# EAGLE design TeensyCtrlr (EAGLE 7.2.0)

## Sheet 1 of 5: Audio Amplifier
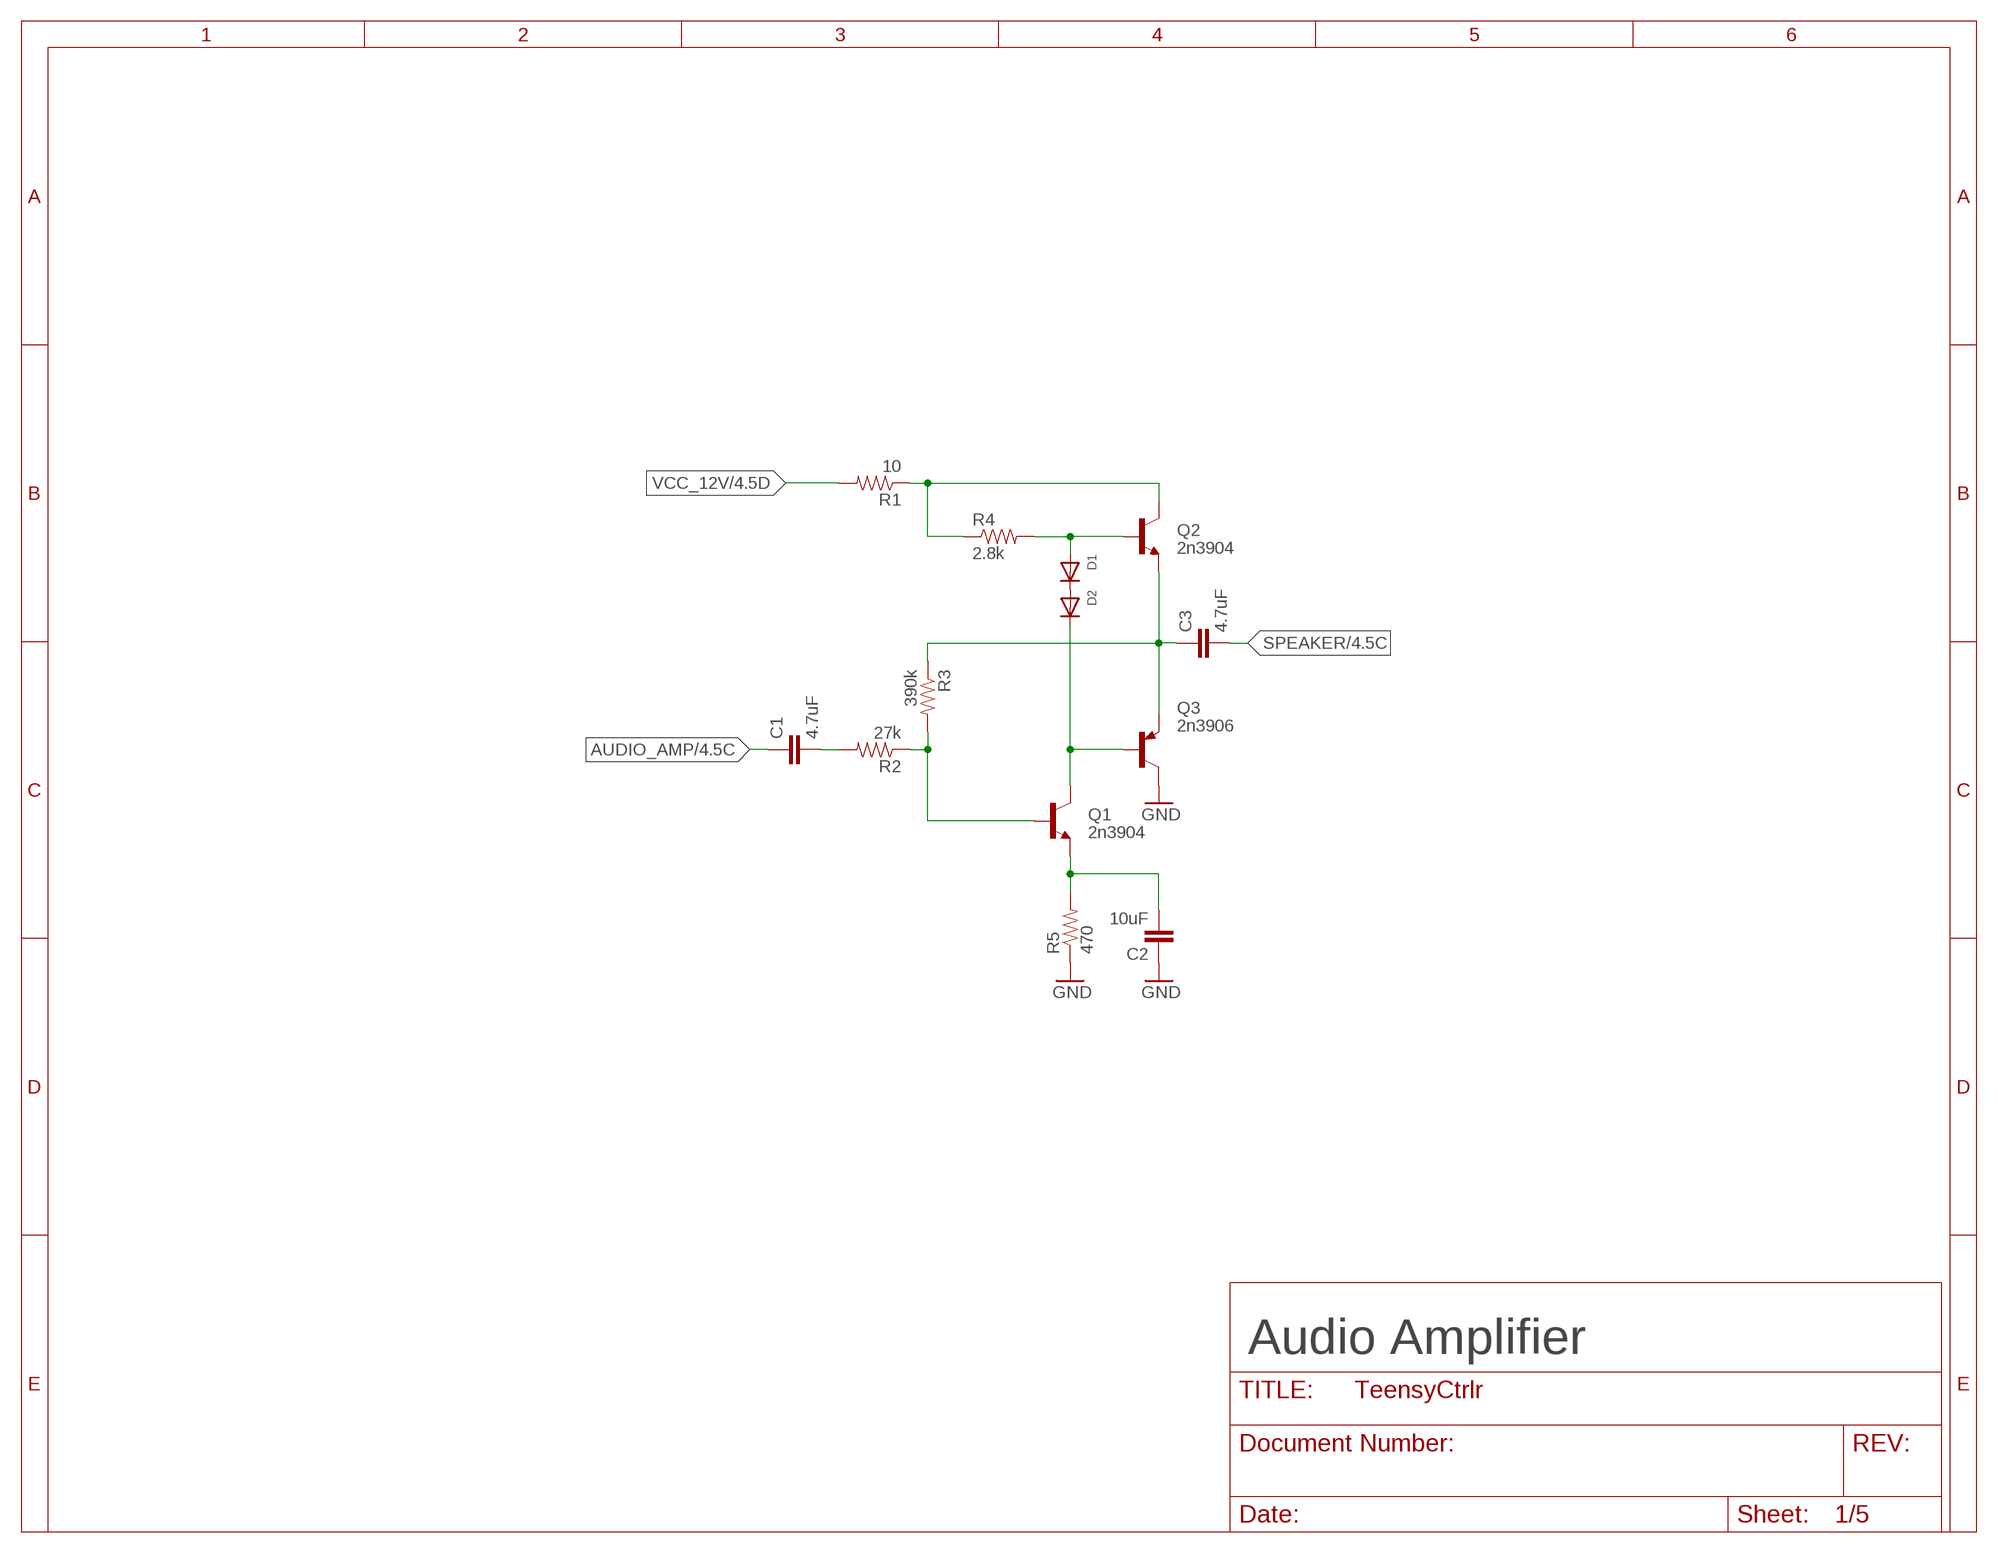
[diagram p0: schematic, sheet 1]

### Parts
C1  4.7uF  CAPPTH  [CAP-PTH-SMALL]
C2  10uF  CAPPTH  [CAP-PTH-SMALL]
C3  4.7uF  CAPPTH  [CAP-PTH-SMALL]
D1  DIODEDO-1N4148  [DO-1N4148]
D2  DIODEDO-1N4148  [DO-1N4148]
Q1  2n3904  TRANSISTOR_NPNTO-92-AMMO  [TO-92-AMMO]
Q2  2n3904  TRANSISTOR_NPNTO-92-AMMO  [TO-92-AMMO]
Q3  2n3906  BC328-25-PNP-TO92-EBC  [TO92-EBC]
R1  10  RESISTOR0805-RES  [0805]
R2  27k  RESISTOR0805-RES  [0805]
R3  390k  RESISTOR0805-RES  [0805]
R4  2.8k  RESISTOR0805-RES  [0805]
R5  470  RESISTOR0805-RES  [0805]

### Nets
AUDIO_AMP: C1.1 ; also sheet 4
GND: C2.1 Q3.C R5.1 ; also sheet 2,3,4,5
N$25: C1.2 R2.2
N$28: Q2.3(C) R1.1 R4.1
N$30: C2.2 Q1.1(E) R5.2
N$40: C3.1 Q2.1(E) Q3.E R3.1
N$41: D1.C D2.A
N$42: D1.A Q2.2(B) R4.2
N$43: D2.C Q1.3(C) Q3.B
N$53: Q1.2(B) R2.1 R3.2
SPEAKER: C3.2 ; also sheet 4
VCC_12V: R1.2 ; also sheet 4

### Notes on the sheet
- Audio Amplifier

## Sheet 2 of 5: Mixer
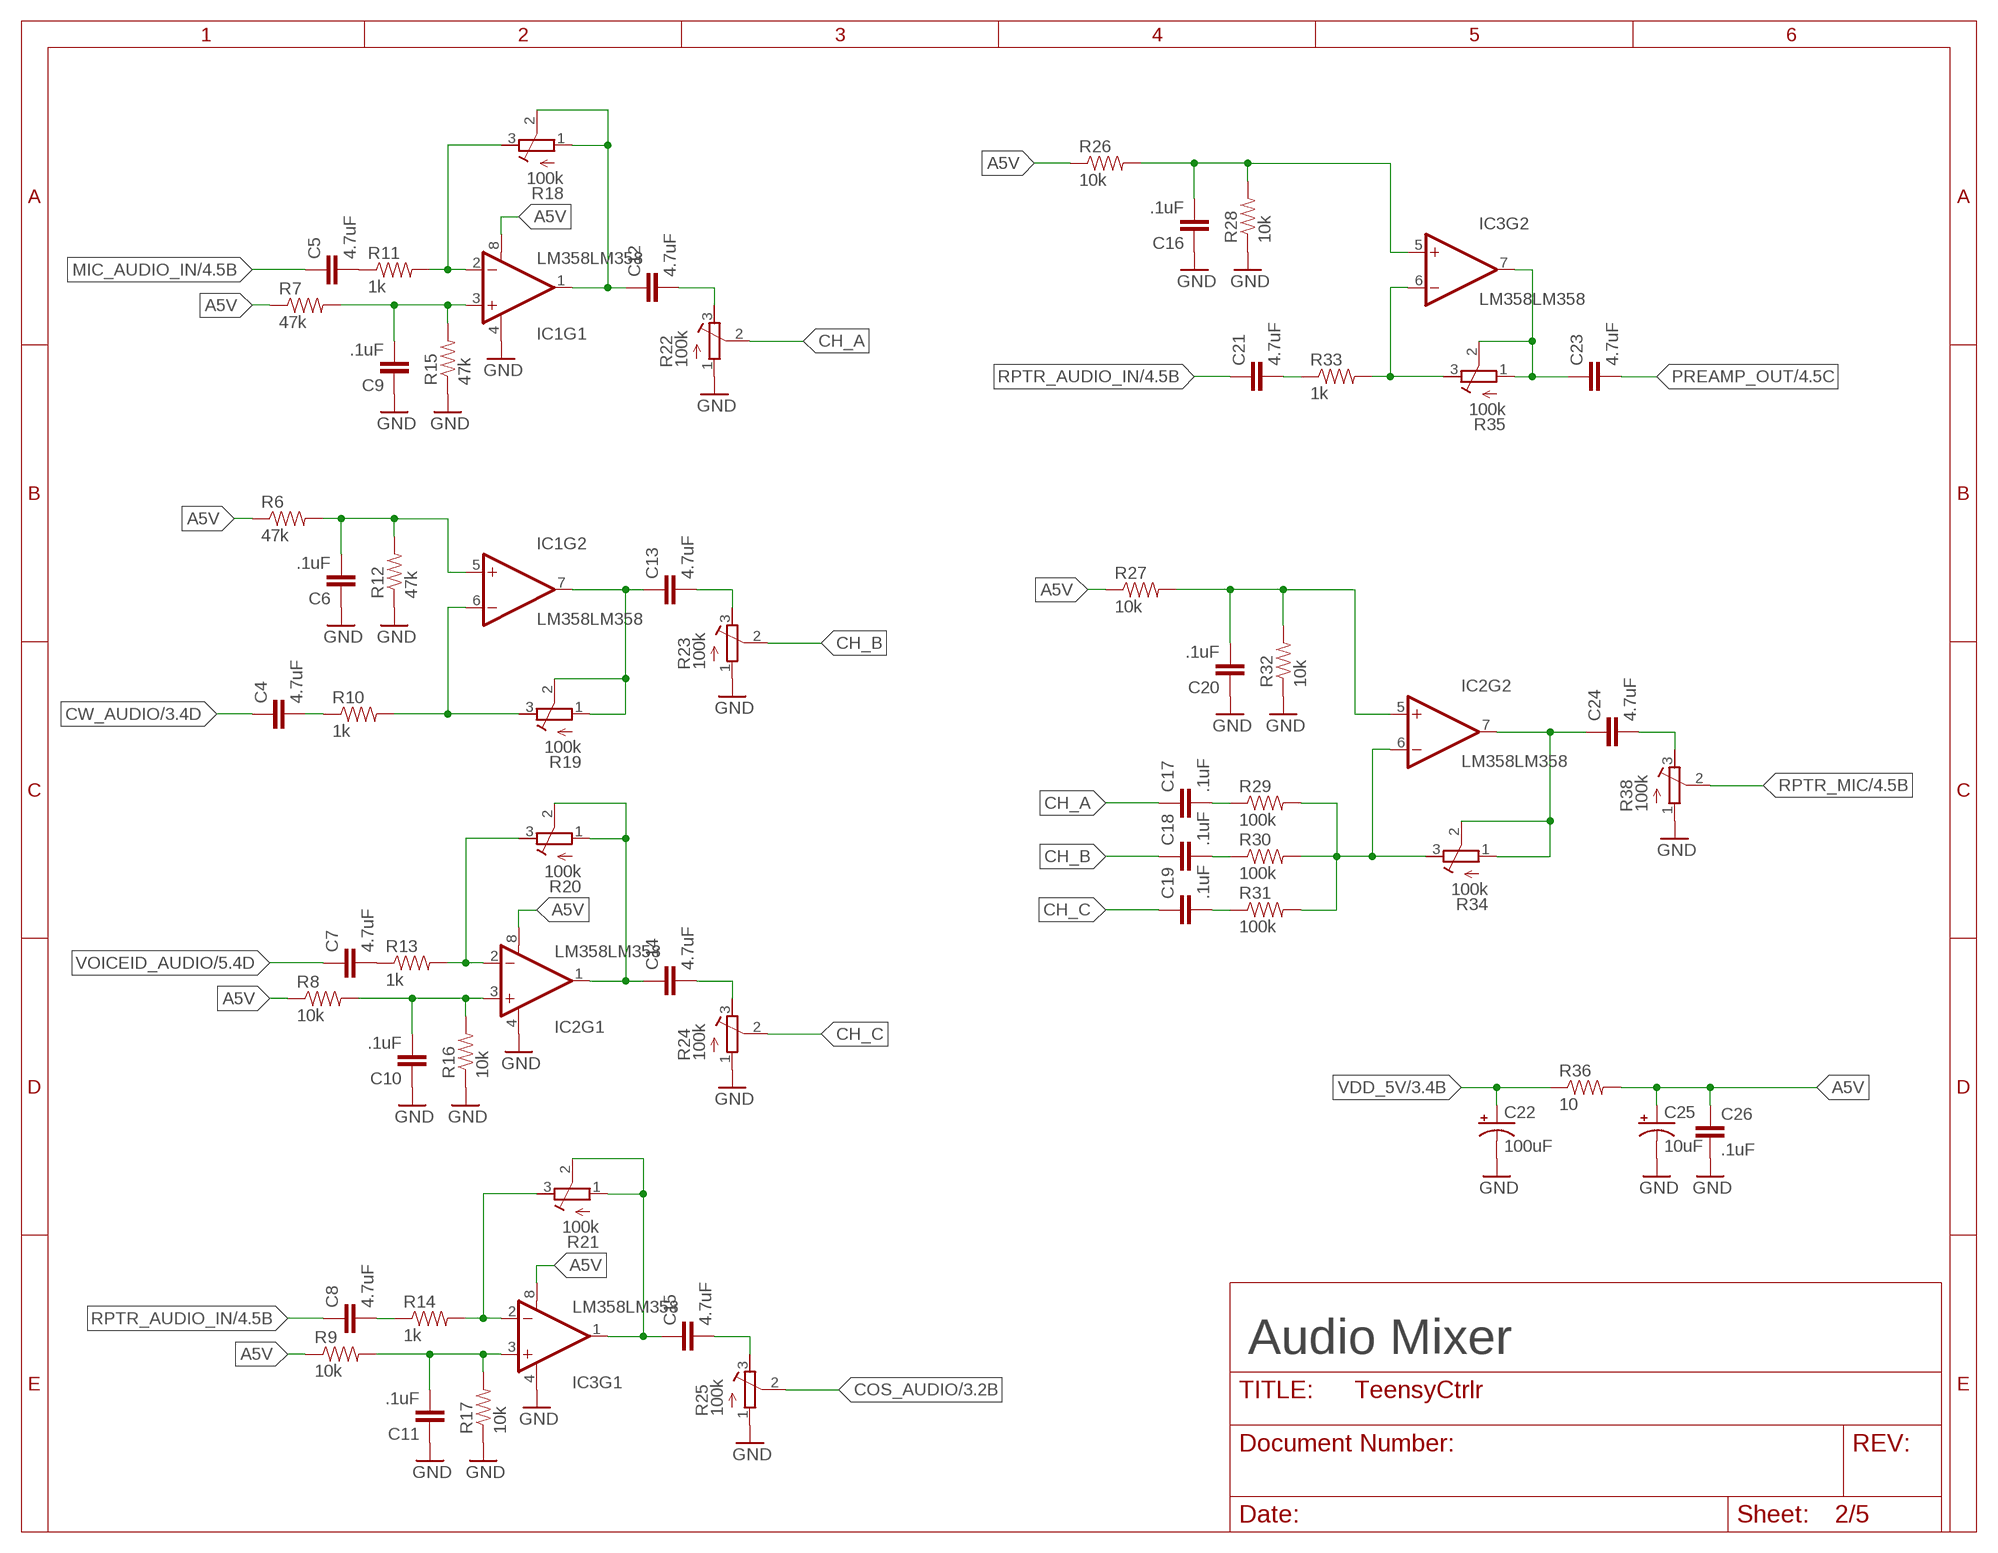
[diagram p1: schematic, sheet 2]

### Parts
C4  4.7uF  CAPPTH2  [CAP-PTH-SMALL2]
C5  4.7uF  CAPPTH2  [CAP-PTH-SMALL2]
C6  .1uF  CAP0805  [0805]
C7  4.7uF  CAPPTH2  [CAP-PTH-SMALL2]
C8  4.7uF  CAPPTH2  [CAP-PTH-SMALL2]
C9  .1uF  CAP0805  [0805]
C10  .1uF  CAP0805  [0805]
C11  .1uF  CAP0805  [0805]
C12  4.7uF  CAPPTH2  [CAP-PTH-SMALL2]
C13  4.7uF  CAPPTH2  [CAP-PTH-SMALL2]
C14  4.7uF  CAPPTH2  [CAP-PTH-SMALL2]
C15  4.7uF  CAPPTH2  [CAP-PTH-SMALL2]
C16  .1uF  CAP0805  [0805]
C17  .1uF  CAP0805  [0805]
C18  .1uF  CAP0805  [0805]
C19  .1uF  CAP0805  [0805]
C20  .1uF  CAP0805  [0805]
C21  4.7uF  CAPPTH2  [CAP-PTH-SMALL2]
C22  100uF  CAP_POLPTH2  [CPOL-RADIAL-10UF-25V]
C23  4.7uF  CAPPTH2  [CAP-PTH-SMALL2]
C24  4.7uF  CAPPTH2  [CAP-PTH-SMALL2]
C25  10uF  CAP_POLPTH1  [CPOL-RADIAL-100UF-25V]
C26  .1uF  CAP0805  [0805]
IC1  LM358LM358  [SOIC8]
IC2  LM358LM358  [SOIC8]
IC3  LM358LM358  [SOIC8]
R6  47k  RESISTOR0805-RES  [0805]
R7  47k  RESISTOR0805-RES  [0805]
R8  10k  RESISTOR0805-RES  [0805]
R9  10k  RESISTOR0805-RES  [0805]
R10  1k  RESISTOR0805-RES  [0805]
R11  1k  RESISTOR0805-RES  [0805]
R12  47k  RESISTOR0805-RES  [0805]
R13  1k  RESISTOR0805-RES  [0805]
R14  1k  RESISTOR0805-RES  [0805]
R15  47k  RESISTOR0805-RES  [0805]
R16  10k  RESISTOR0805-RES  [0805]
R17  10k  RESISTOR0805-RES  [0805]
R18  100k  R-TRIMM3296X  [RTRIM3296X]
R19  100k  R-TRIMM3296X  [RTRIM3296X]
R20  100k  R-TRIMM3296X  [RTRIM3296X]
R21  100k  R-TRIMM3296X  [RTRIM3296X]
R22  100k  R-TRIMM3296X  [RTRIM3296X]
R23  100k  R-TRIMM3296X  [RTRIM3296X]
R24  100k  R-TRIMM3296X  [RTRIM3296X]
R25  100k  R-TRIMM3296X  [RTRIM3296X]
R26  10k  RESISTOR0805-RES  [0805]
R27  10k  RESISTOR0805-RES  [0805]
R28  10k  RESISTOR0805-RES  [0805]
R29  100k  RESISTOR0805-RES  [0805]
R30  100k  RESISTOR0805-RES  [0805]
R31  100k  RESISTOR0805-RES  [0805]
R32  10k  RESISTOR0805-RES  [0805]
R33  1k  RESISTOR0805-RES  [0805]
R34  100k  R-TRIMM3296X  [RTRIM3296X]
R35  100k  R-TRIMM3296X  [RTRIM3296X]
R36  10  RESISTOR0805-RES  [0805]
R38  100k  R-TRIMM3296X  [RTRIM3296X]

### Nets
A5V: C25.1(+) C26.1 IC1.8(V+) IC2.8(V+) IC3.8(V+) R6.1 R7.1 R8.1 R9.1 R26.1 R27.1 R36.2
CH_A: C17.1 R22.2(S)
CH_B: C18.1 R23.2(S)
CH_C: C19.1 R24.2(S)
COS_AUDIO: R25.2(S) ; also sheet 3
CW_AUDIO: C4.1 ; also sheet 3
GND: C6.1 C9.1 C10.1 C11.1 C16.1 C20.1 C22.2(-) C25.2(-) C26.2 IC1.4(V-) IC2.4(V-) IC3.4(V-) R12.1 R15.1 R16.1 R17.1 R22.1(A) R23.1(A) R24.1(A) R25.1(A) R28.1 R32.1 R38.1(A) ; also sheet 1,3,4,5
MIC_AUDIO_IN: C5.1 ; also sheet 4
N$44: IC1.2(-IN) R11.2 R18.3(E)
N$45: C9.2 IC1.3(+IN) R7.2 R15.2
N$54: C5.2 R11.1
N$55: C12.1 IC1.1(OUT) R18.1(A) R18.2(S)
N$56: C12.2 R22.3(E)
N$57: IC1.6(-IN) R10.2 R19.3(E)
N$58: C6.2 IC1.5(+IN) R6.2 R12.2
N$59: C4.2 R10.1
N$60: C13.1 IC1.7(OUT) R19.1(A) R19.2(S)
N$61: C13.2 R23.3(E)
N$62: IC2.2(-IN) R13.2 R20.3(E)
N$63: C10.2 IC2.3(+IN) R8.2 R16.2
N$64: C7.2 R13.1
N$65: C14.1 IC2.1(OUT) R20.1(A) R20.2(S)
N$66: C14.2 R24.3(E)
N$67: IC2.6(-IN) R29.2 R30.2 R31.2 R34.3(E)
N$68: C20.2 IC2.5(+IN) R27.2 R32.2
N$69: C24.1 IC2.7(OUT) R34.1(A) R34.2(S)
N$70: C24.2 R38.3(E)
N$71: IC3.2(-IN) R14.2 R21.3(E)
N$72: C11.2 IC3.3(+IN) R9.2 R17.2
N$73: C8.2 R14.1
N$74: C15.1 IC3.1(OUT) R21.1(A) R21.2(S)
N$75: C15.2 R25.3(E)
N$76: IC3.6(-IN) R33.2 R35.3(E)
N$77: C16.2 IC3.5(+IN) R26.2 R28.2
N$78: C21.2 R33.1
N$79: C23.1 IC3.7(OUT) R35.1(A) R35.2(S)
N$87: C17.2 R29.1
N$88: C18.2 R30.1
N$89: C19.2 R31.1
PREAMP_OUT: C23.2 ; also sheet 4
RPTR_AUDIO_IN: C8.1 C21.1 ; also sheet 4,5
RPTR_MIC: R38.2(S) ; also sheet 4,5
VDD_5V: C22.1(+) R36.1 ; also sheet 3,4,5
VOICEID_AUDIO: C7.1 ; also sheet 5

### Notes on the sheet
- Audio Mixer

## Sheet 3 of 5: Teensy
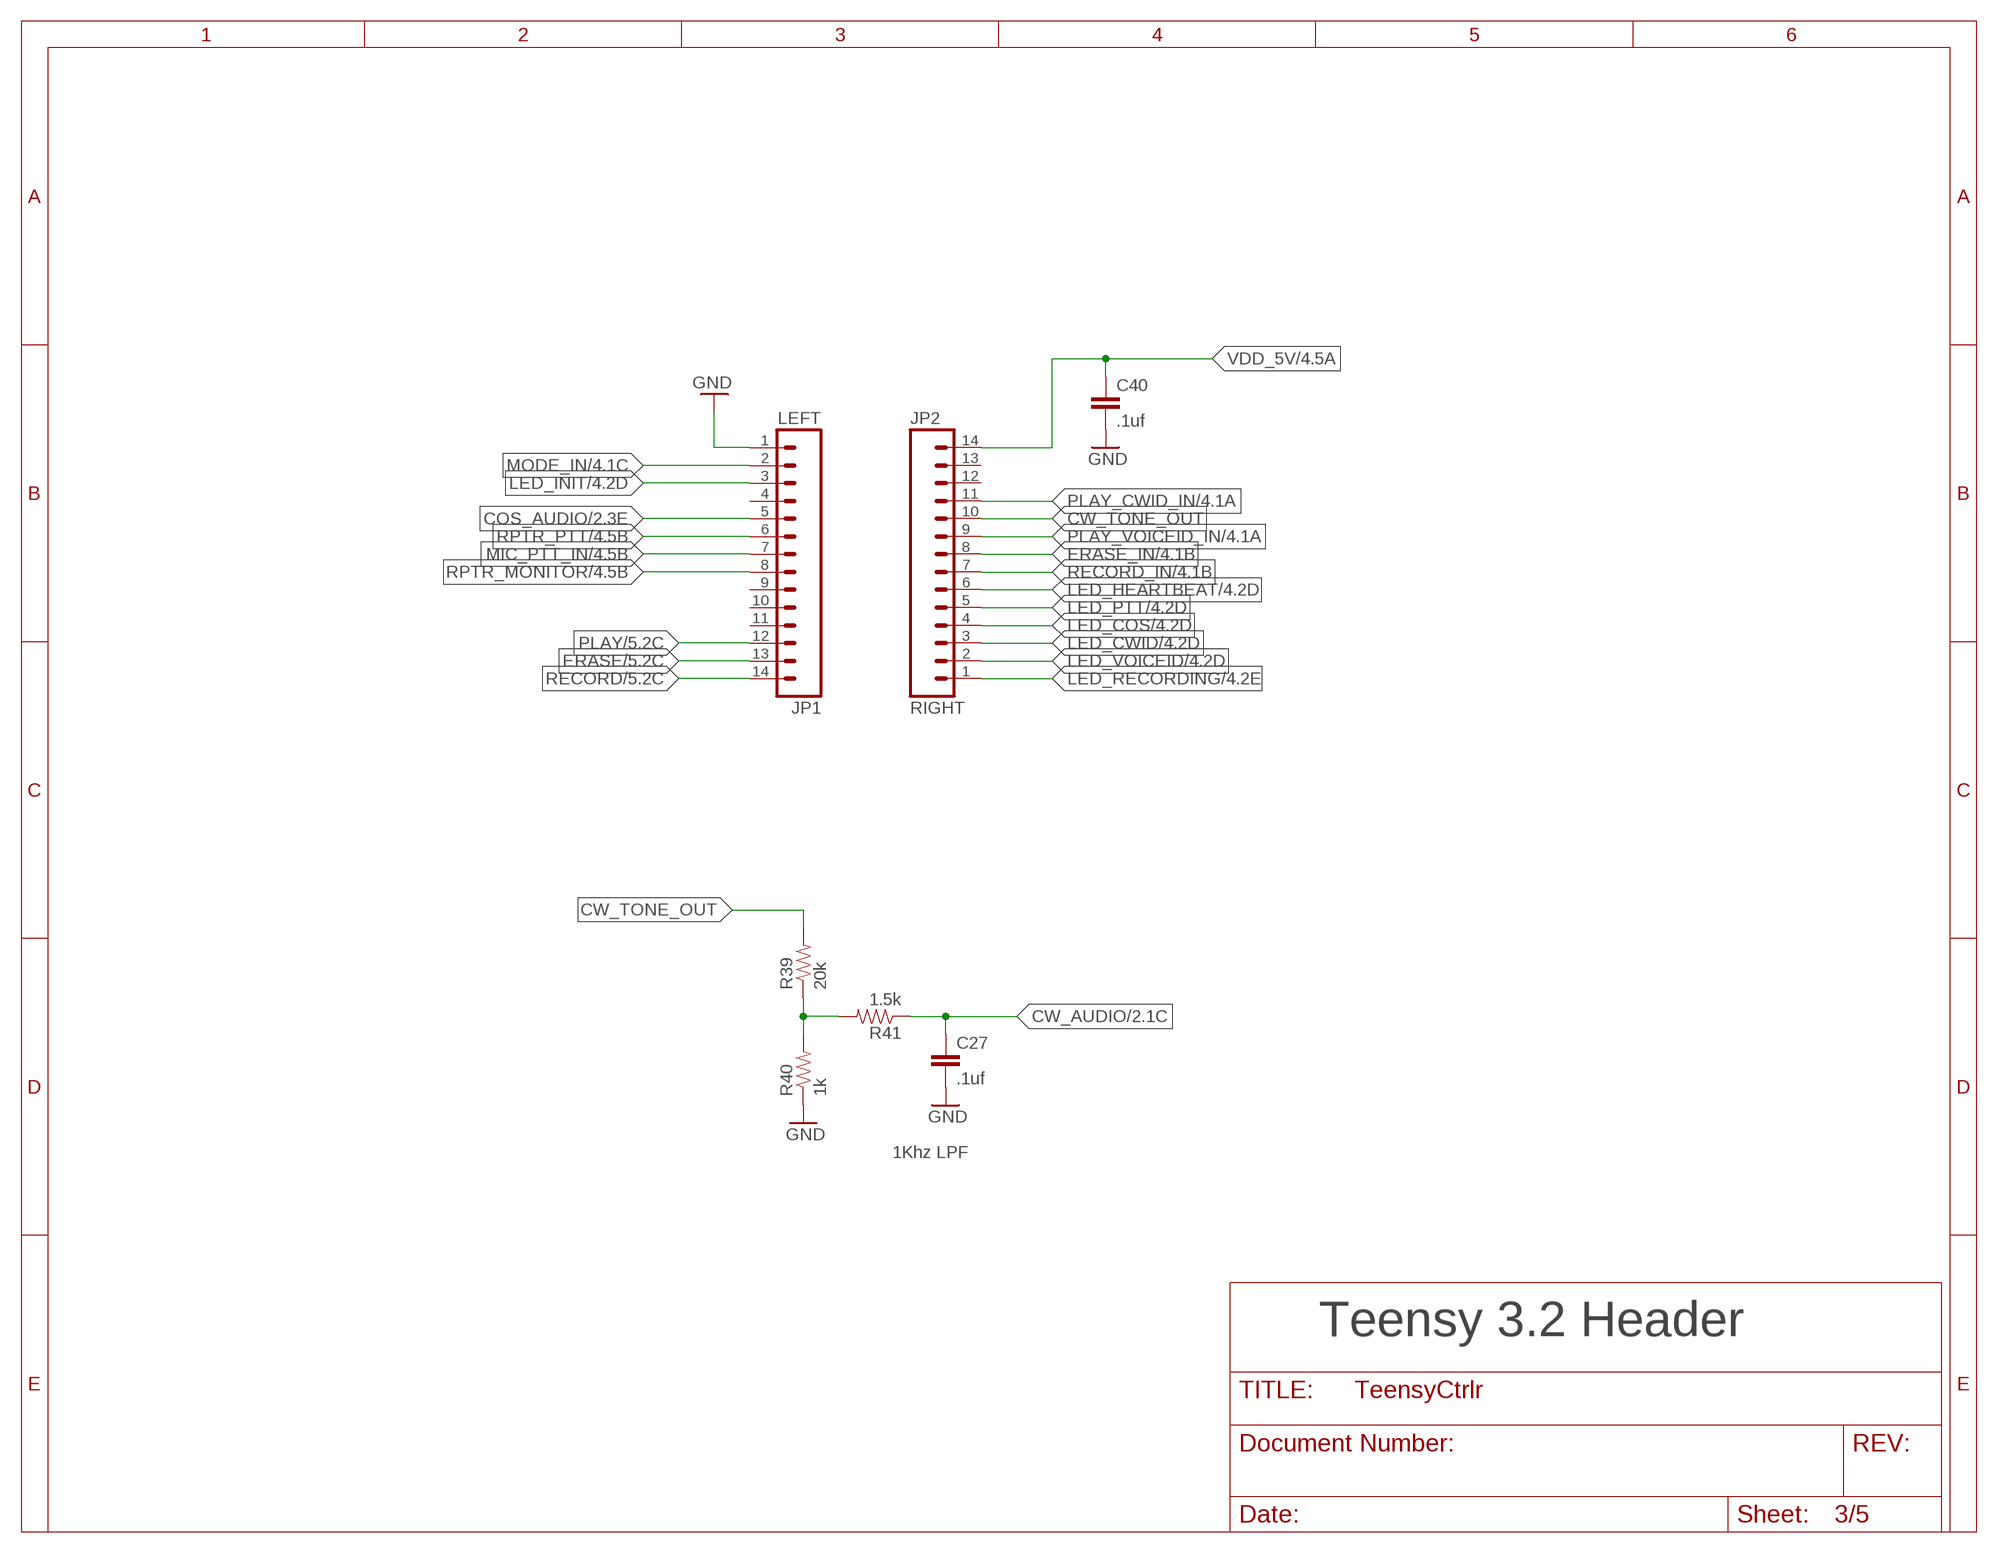
[diagram p2: schematic, sheet 3]

### Parts
C27  .1uf  CAP0805  [0805]
C40  .1uf  CAP0805  [0805]
JP1  LEFT  M14LONGPADS  [1X14-LONGPADS]
JP2  RIGHT  M14LONGPADS  [1X14-LONGPADS]
R39  20k  RESISTOR0805-RES  [0805]
R40  1k  RESISTOR0805-RES  [0805]
R41  1.5k  RESISTOR0805-RES  [0805]

### Nets
COS_AUDIO: JP1.5 ; also sheet 2
CW_AUDIO: C27.1 R41.1 ; also sheet 2
CW_TONE_OUT: JP2.10 R39.2
ERASE: JP1.13 ; also sheet 5
ERASE_IN: JP2.8 ; also sheet 4
GND: C27.2 C40.2 JP1.1 R40.1 ; also sheet 1,2,4,5
LED_COS: JP2.4 ; also sheet 4
LED_CWID: JP2.3 ; also sheet 4
LED_HEARTBEAT: JP2.6 ; also sheet 4
LED_INIT: JP1.3 ; also sheet 4
LED_PTT: JP2.5 ; also sheet 4
LED_RECORDING: JP2.1 ; also sheet 4
LED_VOICEID: JP2.2 ; also sheet 4
MIC_PTT_IN: JP1.7 ; also sheet 4
MODE_IN: JP1.2 ; also sheet 4
N$16: R39.1 R40.2 R41.2
PLAY: JP1.12 ; also sheet 5
PLAY_CWID_IN: JP2.11 ; also sheet 4
PLAY_VOICEID_IN: JP2.9 ; also sheet 4
RECORD: JP1.14 ; also sheet 5
RECORD_IN: JP2.7 ; also sheet 4
RPTR_MONITOR: JP1.8 ; also sheet 4
RPTR_PTT: JP1.6 ; also sheet 4
VDD_5V: C40.1 JP2.14 ; also sheet 2,4,5
Unconnected: JP1.4 JP1.9 JP1.10 JP1.11 JP2.12 JP2.13

### Notes on the sheet
- 1Khz LPF
- Teensy 3.2 Header

## Sheet 4 of 5: I/O and Power
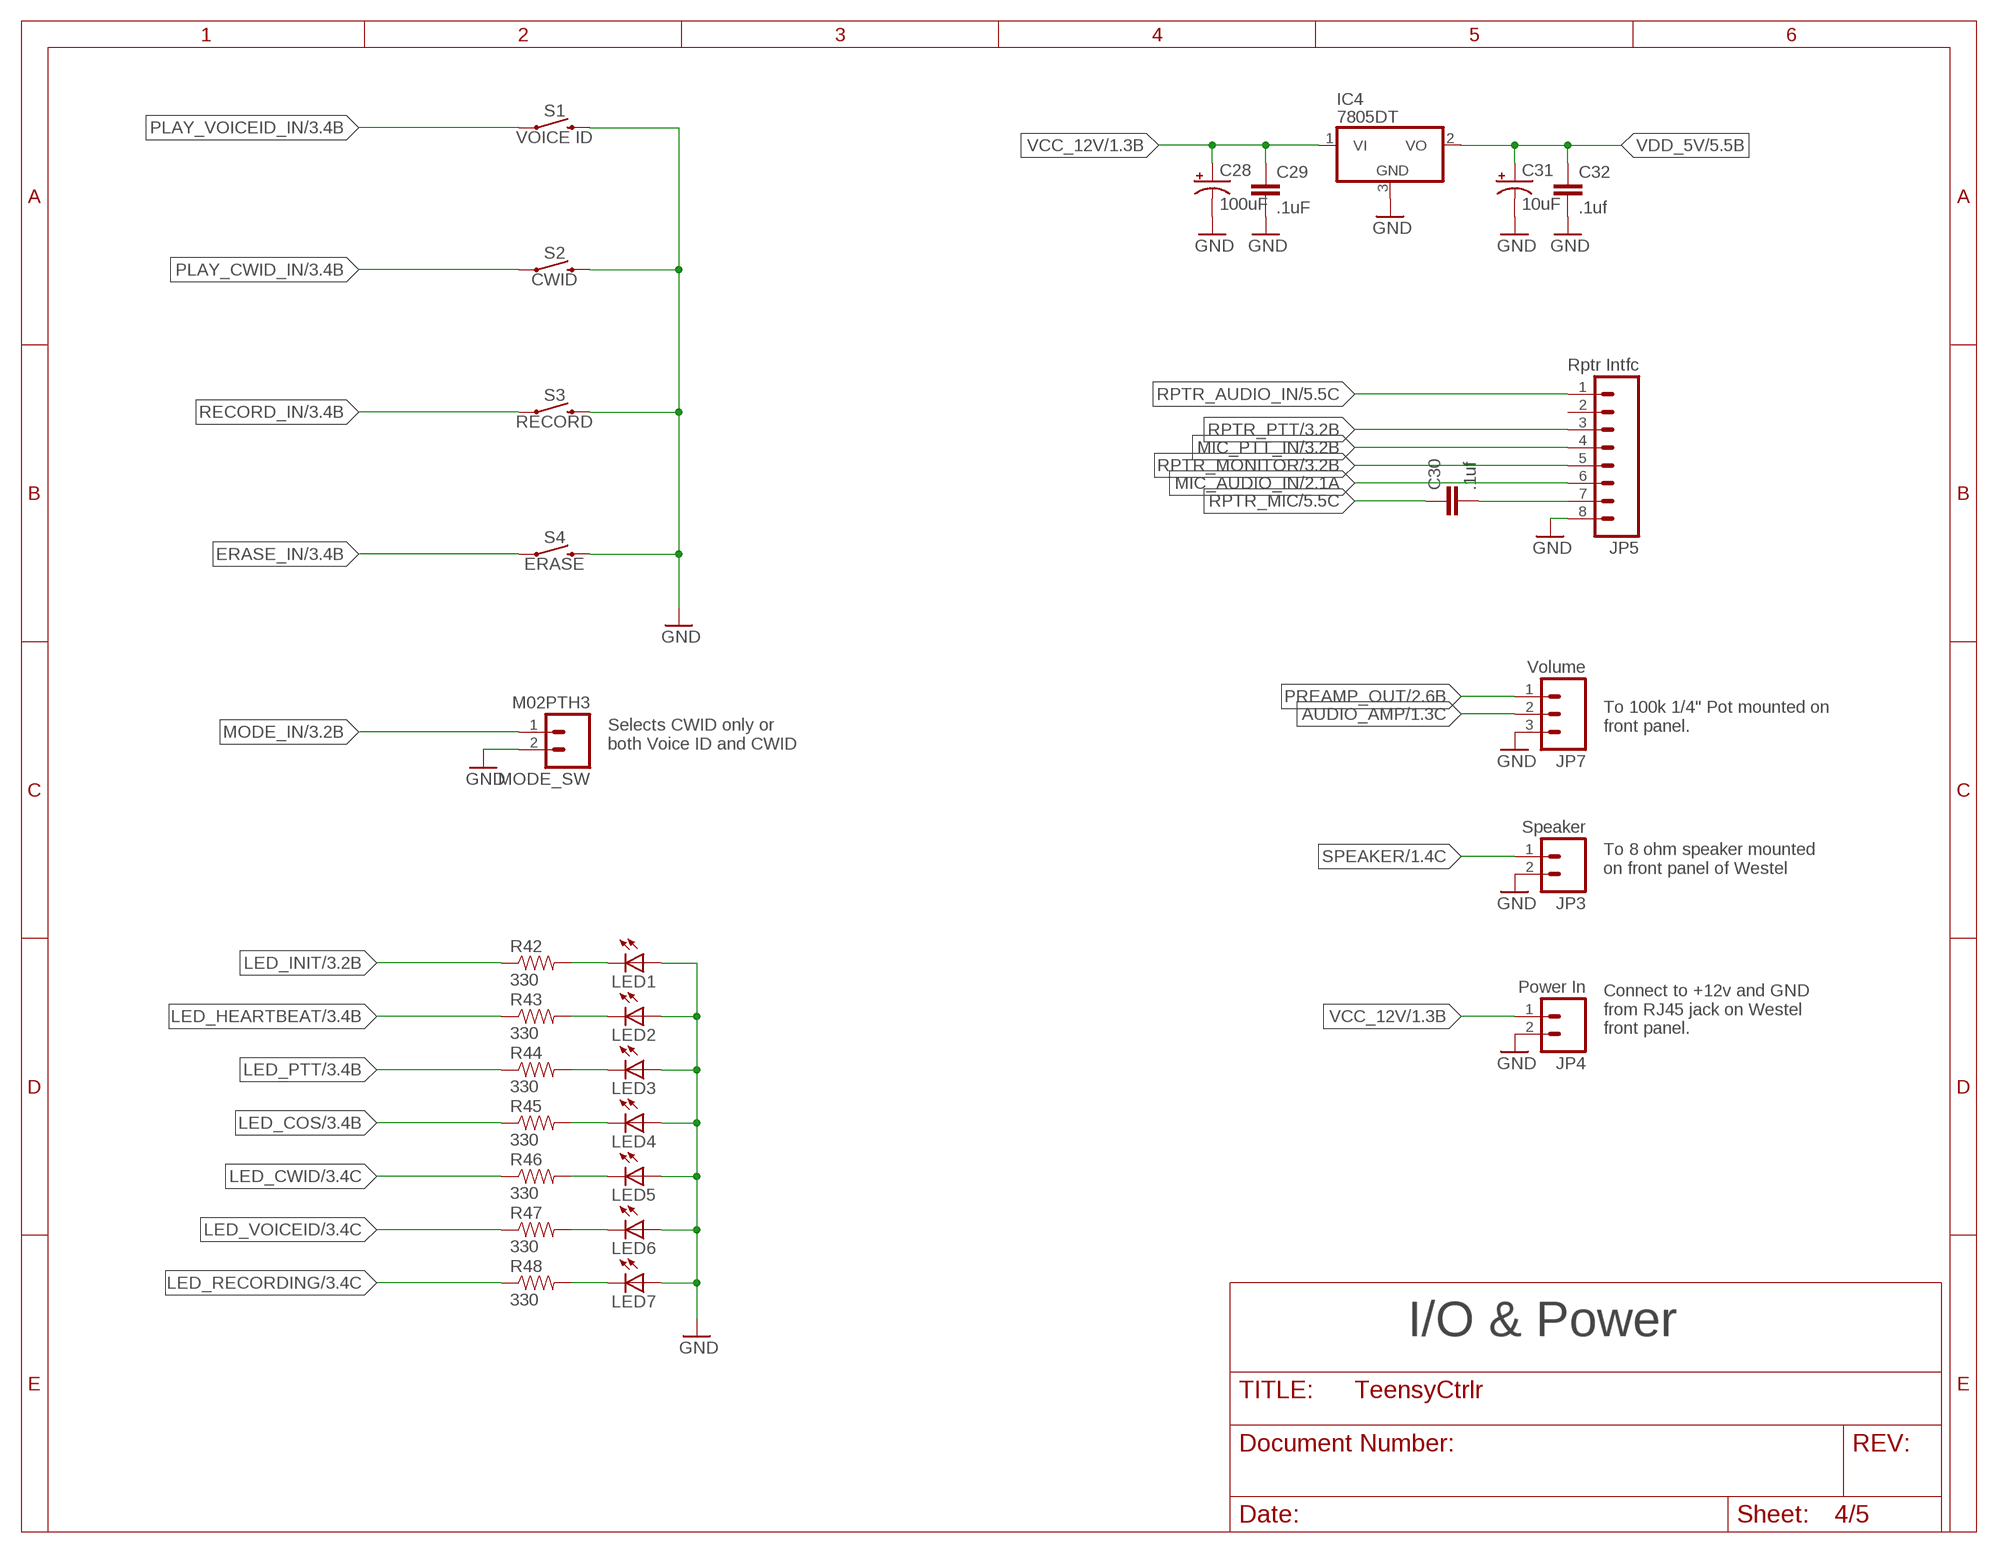
[diagram p3: schematic, sheet 4]

### Parts
C28  100uF  CAP_POLPTH4  [CPOL-RADIAL-1000UF-25V]
C29  .1uF  CAP0805  [0805]
C30  .1uf  CAP0805  [0805]
C31  10uF  CAP_POLPTH1  [CPOL-RADIAL-100UF-25V]
C32  .1uf  CAP0805  [0805]
IC4  7805DT  [TO252]
JP3  Speaker  M02PTH3  [1X02_LONGPADS]
JP4  Power In  M02PTH3  [1X02_LONGPADS]
JP5  Rptr Intfc  M08LONGPADS  [1X08_LONGPADS]
JP7  Volume  M03LONGPADS  [1X03_LONGPADS]
LED1  LED5MM  [LED5MM]
LED2  LED5MM  [LED5MM]
LED3  LED5MM  [LED5MM]
LED4  LED5MM  [LED5MM]
LED5  LED5MM  [LED5MM]
LED6  LED5MM  [LED5MM]
LED7  LED5MM  [LED5MM]
MODE_SW  M02PTH3  [1X02_LONGPADS]
R42  330  RESISTOR0805-RES  [0805]
R43  330  RESISTOR0805-RES  [0805]
R44  330  RESISTOR0805-RES  [0805]
R45  330  RESISTOR0805-RES  [0805]
R46  330  RESISTOR0805-RES  [0805]
R47  330  RESISTOR0805-RES  [0805]
R48  330  RESISTOR0805-RES  [0805]
S1  VOICE ID  MOMENTARY-SWITCH-SPST-PTH-6.0MM  [TACTILE_SWITCH_PTH_6.0MM]
S2  CWID  MOMENTARY-SWITCH-SPST-PTH-6.0MM  [TACTILE_SWITCH_PTH_6.0MM]
S3  RECORD  MOMENTARY-SWITCH-SPST-PTH-6.0MM  [TACTILE_SWITCH_PTH_6.0MM]
S4  ERASE  MOMENTARY-SWITCH-SPST-PTH-6.0MM  [TACTILE_SWITCH_PTH_6.0MM]

### Nets
AUDIO_AMP: JP7.2 ; also sheet 1
ERASE_IN: S4.1 ; also sheet 3
GND: C28.- C29.2 C31.2(-) C32.2 IC4.3(GND) JP3.2 JP4.2 JP5.8 JP7.3 LED1.A LED2.A LED3.A LED4.A LED5.A LED6.A LED7.A MODE_SW.2 S1.3 S2.3 S3.3 S4.3 ; also sheet 1,2,3,5
LED_COS: R45.1 ; also sheet 3
LED_CWID: R46.1 ; also sheet 3
LED_HEARTBEAT: R43.1 ; also sheet 3
LED_INIT: R42.1 ; also sheet 3
LED_PTT: R44.1 ; also sheet 3
LED_RECORDING: R48.1 ; also sheet 3
LED_VOICEID: R47.1 ; also sheet 3
MIC_AUDIO_IN: JP5.6 ; also sheet 2
MIC_PTT_IN: JP5.4 ; also sheet 3
MODE_IN: MODE_SW.1 ; also sheet 3
N$9: LED1.K(C) R42.2
N$10: LED2.K(C) R43.2
N$11: LED3.K(C) R44.2
N$12: LED4.K(C) R45.2
N$13: LED5.K(C) R46.2
N$14: LED6.K(C) R47.2
N$15: LED7.K(C) R48.2
N$17: C30.2 JP5.7
PLAY_CWID_IN: S2.1 ; also sheet 3
PLAY_VOICEID_IN: S1.1 ; also sheet 3
PREAMP_OUT: JP7.1 ; also sheet 2
RECORD_IN: S3.1 ; also sheet 3
RPTR_AUDIO_IN: JP5.1 ; also sheet 2,5
RPTR_MIC: C30.1 ; also sheet 2,5
RPTR_MONITOR: JP5.5 ; also sheet 3
RPTR_PTT: JP5.3 ; also sheet 3
SPEAKER: JP3.1 ; also sheet 1
VCC_12V: C28.+ C29.1 IC4.1(VI) JP4.1 ; also sheet 1
VDD_5V: C31.1(+) C32.1 IC4.2(VO) ; also sheet 2,3,5
Unconnected: JP5.2

### Notes on the sheet
- To 100k 1/4" Pot mounted on
  front panel.
- Selects CWID only or
  both Voice ID and CWID
- To 8 ohm speaker mounted
  on front panel of Westel
- Connect to +12v and GND 
  from RJ45 jack on Westel 
  front panel.
- I/O & Power

## Sheet 5 of 5: Voice Ctrl
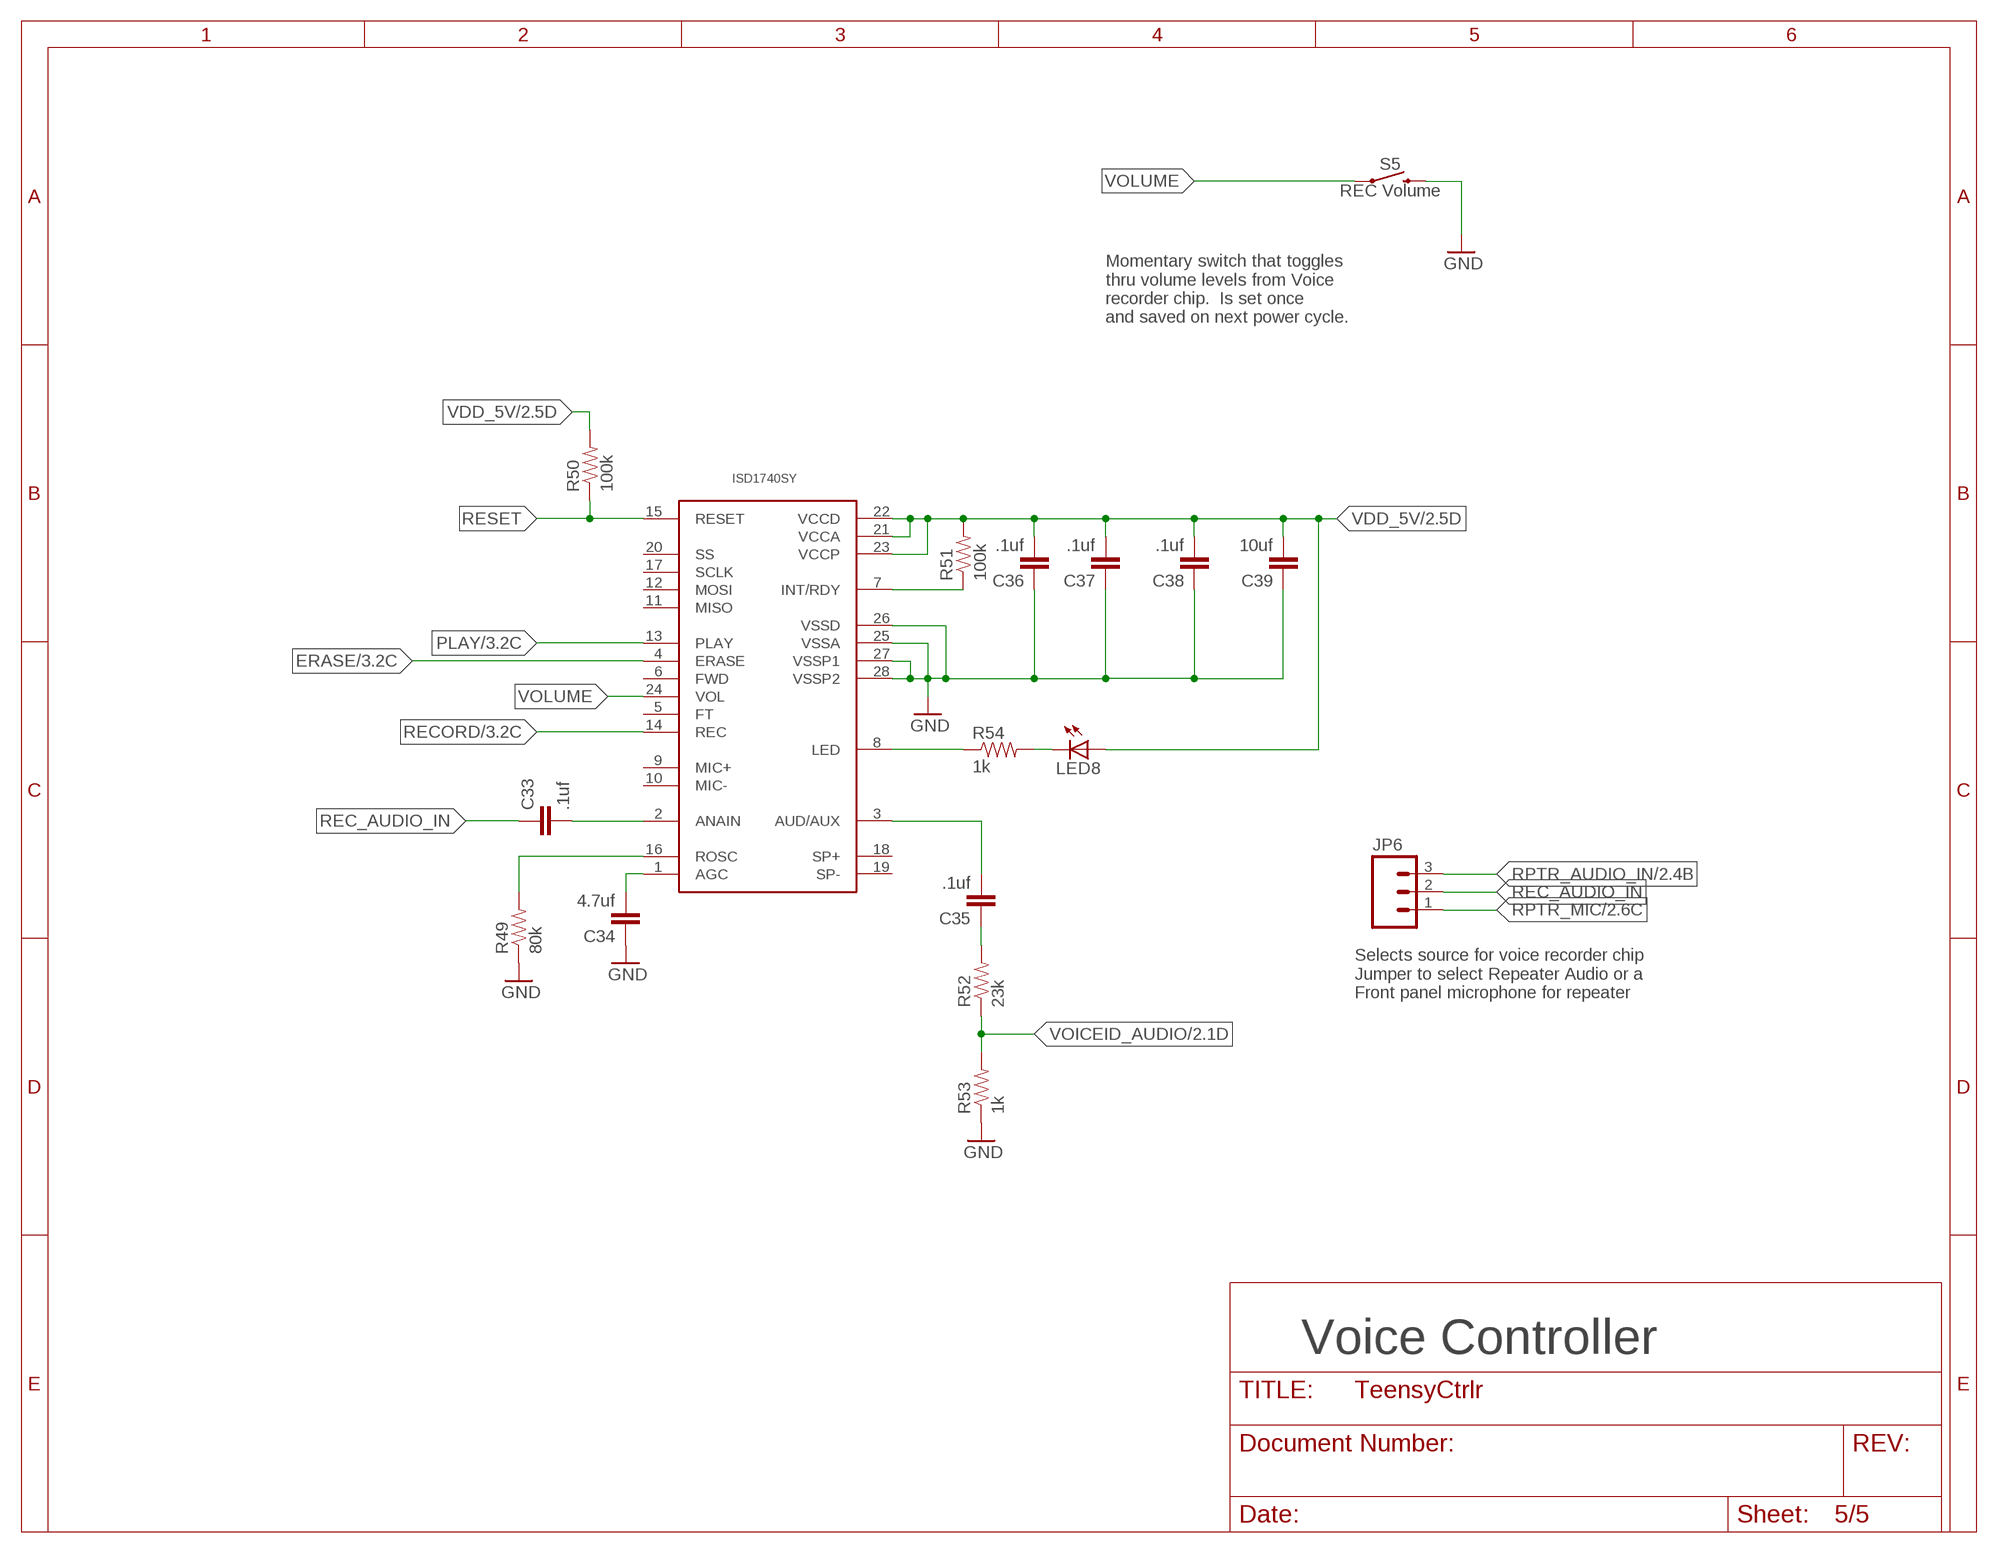
[diagram p4: schematic, sheet 5]

### Parts
C33  .1uf  CAP0805  [0805]
C34  4.7uf  CAP0805  [0805]
C35  .1uf  CAP0805  [0805]
C36  .1uf  CAP0805  [0805]
C37  .1uf  CAP0805  [0805]
C38  .1uf  CAP0805  [0805]
C39  10uf  CAP0805  [0805]
IC$1  ISD1740SYSOIC28  [SOIC-28]
JP6  M03LONGPADS  [1X03_LONGPADS]
LED8  LEDCHIP-LED0805  [CHIP-LED0805]
R49  80k  RESISTOR0805-RES  [0805]
R50  100k  RESISTOR0805-RES  [0805]
R51  100k  RESISTOR0805-RES  [0805]
R52  23k  RESISTOR0805-RES  [0805]
R53  1k  RESISTOR0805-RES  [0805]
R54  1k  RESISTOR0805-RES  [0805]
S5  REC Volume  MOMENTARY-SWITCH-SPST-PTH-6.0MM  [TACTILE_SWITCH_PTH_6.0MM]

### Nets
ERASE: IC$1.4(ERASE) ; also sheet 3
GND: C34.1 C36.1 C37.1 C38.1 C39.1 IC$1.25(VSSA) IC$1.26(VSSD) IC$1.27(VSSP1) IC$1.28(VSSP2) R49.1 R53.1 S5.3 ; also sheet 1,2,3,4
N$1: C33.2 IC$1.2(ANAIN)
N$2: C35.2 IC$1.3(AUD/AUX)
N$3: C35.1 R52.2
N$4: C34.2 IC$1.1(AGC)
N$5: IC$1.16(ROSC) R49.2
N$6: IC$1.7(INT/RDY) R51.1
N$7: IC$1.8(LED) R54.1
N$8: LED8.C R54.2
PLAY: IC$1.13(PLAY) ; also sheet 3
REC_AUDIO_IN: C33.1 JP6.2
RECORD: IC$1.14(REC) ; also sheet 3
RESET: IC$1.15(RESET) R50.1
RPTR_AUDIO_IN: JP6.3 ; also sheet 2,4
RPTR_MIC: JP6.1 ; also sheet 2,4
VDD_5V: C36.2 C37.2 C38.2 C39.2 IC$1.21(VCCA) IC$1.22(VCCD) IC$1.23(VCCP) LED8.A R50.2 R51.2 ; also sheet 2,3,4
VOICEID_AUDIO: R52.1 R53.2 ; also sheet 2
VOLUME: IC$1.24(VOL) S5.1
Unconnected: IC$1.5(FT) IC$1.6(FWD) IC$1.9(MIC+) IC$1.10(MIC-) IC$1.11(MISO) IC$1.12(MOSI) IC$1.17(SCLK) IC$1.18(SP+) IC$1.19(SP-) IC$1.20(SS)

### Notes on the sheet
- Momentary switch that toggles
  thru volume levels from Voice
  recorder chip.  Is set once 
  and saved on next power cycle.
- Selects source for voice recorder chip
  Jumper to select Repeater Audio or a
  Front panel microphone for repeater
- Voice Controller

## Library data of the parts
C1-C21 C23 C24 C26 C27 C29 C30 C32-C40 = SparkFun-Capacitors:CAP: Capacitor Standard 0603 ceramic capacitor, and 0.1" leaded capacitor.
C22 C25 C28 C31 = SparkFun-Capacitors:CAP_POL: Capacitor Polarized These are standard SMD and PTH capacitors. Normally 10uF, 47uF, and 100uF in electrolytic and tantalum varieties. Always verify the external diameter of the through hole cap, it varies with capacity, voltage, and manufacturer. The EIA devices should be standard.
D1 D2 = adafruit:DIODE: Diode SMADIODE - SMA Surface Mount Package 20V 1A Schottky Diode Digikey: 641-1014-6-ND DO-1N4148 - Through Hole Small Current Diode SOD-123 20V 1 A (.5mV Vf) Schottky Diode - Digikey: MBRX120TPMSCT-ND SOD-323 10V 570mA (.38mV Vf, 3ns) Schottky Diode - Digikey: ZLLS410CT-ND SOD-523 30V 30mA Schottky Diode (RB751S-40TE61) - Digikey: RB751S-40TE61CT-ND SOT23-R/W - SOT23 Package (R = Solder Paste/Reflow Ovens, W = Hand-Soldering) BAT54Film 40V 300mA - Digikey: 497-7162-1-ND
IC1-IC3 = dt-semis:LM358: Jellybean op-amp
IC4 = linear:78*: Positive VOLTAGE REGULATOR Source: http://cache.national.com/ds/LM/LM78L05.pdf http://www.fairchildsemi.com/ds/LM/LM7805.pdf
IC$1 = dt-semis:ISD1740SY
JP1 JP2 = SparkFun-Connectors:M14: Header 14 Standard 14-pin 0.1" header. Use with straight break away headers (SKU : PRT-00116), right angle break away headers (PRT-00553), swiss pins (PRT-00743), machine pins (PRT-00117), and female headers (PRT-00115).
JP3 JP4 MODE_SW = SparkFun-Connectors:M02: Standard 2-pin 0.1" header. Use with - straight break away headers ( PRT-00116) - right angle break away headers (PRT-00553) - swiss pins (PRT-00743) - machine pins (PRT-00117) - female headers (PRT-00115) Molex polarized connector foot print use with: PRT-08233 with associated crimp pins and housings. 2.54_SCREWTERM for use with PRT-10571. 3.5mm Screw Terminal footprints for PRT-08084 5mm Screw Terminal footprints for use with PRT-08432
JP5 = SparkFun-Connectors:M08: Header 8 Standard 8-pin 0.1" header. Use with straight break away headers (SKU : PRT-00116), right angle break away headers (PRT-00553), swiss pins (PRT-00743), machine pins (PRT-00117), and female headers (PRT-00115).
JP6 JP7 = SparkFun-Connectors:M03: Header 3 Standard 3-pin 0.1" header. Use with straight break away headers (SKU : PRT-00116), right angle break away headers (PRT-00553), swiss pins (PRT-00743), machine pins (PRT-00117), and female headers (PRT-00115). Molex polarized connector foot print use with SKU : PRT-08232 with associated crimp pins and housings.
LED1-LED8 = adafruit:LED: LED OSRAM: - CHIPLED LG R971, LG N971, LY N971, LG Q971, LY Q971, LO R971, LY R971 LH N974, LH R974 LS Q976, LO Q976, LY Q976 LO Q996 - Hyper CHIPLED LW Q18S LB Q993, LB Q99A, LB R99A - SideLED LS A670, LO A670, LY A670, LG A670, LP A670 LB A673, LV A673, LT A673, LW A673 LH A674 LY A675 LS A676, LA A676, LO A676, LY A676, LW A676 LS A679, LY A679, LG A679 - Hyper Micro SIDELED® LS Y876, LA Y876, LO Y876, LY Y876 LT Y87S - SmartLED LW L88C, LW L88S LB L89C, LB L89S, LG L890 LS L89K, LO L89K, LY L89K LS L896, LA L896, LO L896, LY L896 - TOPLED LS T670, LO T670, LY T670, LG T670, LP T670 LSG T670, LSP T670, LSY T670, LOP T670, LYG T670 LG T671, LOG T671, LSG T671 LB T673, LV T673, LT T673, LW T673 LH T674 LS T676, LA T676, LO T676, LY T676, LB T676, LH T676, LSB T676, LW T676 LB T67C, LV T67C, LT T67C, LS T67K, LO T67K, LY T67K, LW E67C LS E67B, LA E67B, LO E67B, LY E67B, LB E67C, LV E67C, LT E67C LW T67C LS T679, LY T679, LG T679 LS T770, LO T770, LY T770, LG T770, LP T770 LB T773, LV T773, LT T773, LW T773 LH T774 LS E675, LA E675, LY E675, LS T675 LS T776, LA T776, LO T776, LY T776, LB T776 LHGB T686 LT T68C, LB T68C - Hyper Mini TOPLED® LB M676 - Mini TOPLED Santana® LG M470 LS M47K, LO M47K, LY M47K Source: http://www.osram.convergy.de/
Q1 Q2 = SparkFun-DiscreteSemi:TRANSISTOR_NPN: Generic NPN BJT MMBT2222A - TRANS-08049 (SOT-23, 1A 40V) MPSA42 - TRANS-09116 (SOT-23, 500mA 300V) MMBT5088LT1G - TRANS-11160 (SOT-23, 50 mA 30V) BC547 - COM-08928 <http://www.sparkfun.com/products/8928> (TO-92 45V 100mA) (1.Collector 2.Base 3.Emitter) 2N3904 - COM-00521 <http://www.sparkfun.com/products/521> (TO-92 40V 200mA) (1.Emitter 2.Base 3.Collector) P2N2222A - COM-12852 <http://www.sparkfun.com/products/12852> (TO-92 40V 600mA) (1.Collector 2.Base 3.Emitter)
Q3 = transistor:*-PNP-: PNP Transistror
R1-R17 R26-R33 R36 R39-R54 = SparkFun-Resistors:RESISTOR: Resistor Basic schematic elements and footprints for 0603, 1206, and PTH resistors.
R18-R25 R34 R35 R38 = rcl:R-TRIMM: Trimm resistor
S1-S5 = rr-switch:MOMENTARY-SWITCH-SPST: Momentary Switch (Pushbutton) - SPST Normally-open (NO) SPST momentary switches (buttons, pushbuttons). Variants PTH-12MM - 12mm square, through-hole Momentary Pushbutton Switch - 12mm Square <https://www.sparkfun.com/products/9190> (COM-09190) PTH-6.0MM, PTH-6.0MM-KIT - 6.0mm square, through-hole Mini Pushbutton Switch <https://www.sparkfun.com/products/97> (COM-00097) KIT package intended for soldering kit's - only one side of pads' copper is exposed. PTH-RIGHT-ANGLE-KIT - Right-angle, through-hole Right Angle Tactile Button <https://www.sparkfun.com/products/10791> - Used on SparkFun BigTime Watch Kit <https://www.sparkfun.com/products/11734> SMD-12MM - 12mm square, surface-mount Tactile Button - SMD (12mm) <https://www.sparkfun.com/products/12993> (COM-12993) Used on SparkFun PicoBoard <https://www.sparkfun.com/products/11888> SMD-4.5MM - 4.5mm Square Trackball Switch Used on SparkFun Blackberry Trackballer Breakout <https://www.sparkfun.com/products/13169> SMD-4.6MMX2.8MM - 4.60mm x 2.80mm, surface mount Used on SparkFun SAMD21 Mini Breakout <https://www.sparkfun.com/products/13664> SMD-5.2MM, SMD-5.2-REDUNDANT - 5.2mm square, surface-mount Mini Pushbutton Switch - SMD <https://www.sparkfun.com/products/8720> (COM-08720) Used on Arduino Pro Mini <https://www.sparkfun.com/products/11114> REDUNDANT package connects both switch circuits together SMD-6.0X3.5MM - 6.0 x 3.5mm, surface mount Momentary Reset Switch SMD <https://www.sparkfun.com/products/8229> (COM-08229) SMD-6.2MM-TALL - 6.2mm square, surface mount Tactile Button - SMD (6mm) <https://www.sparkfun.com/products/12992> Used on SparkFun Digital Sandbox <https://www.sparkfun.com/products/12651> SMD-RIGHT-ANGLE - Right-angle, surface mount Used on SparkFun Block for Intel® Edison - Arduino <https://www.sparkfun.com/products/13036>; PROD_ID: SWCH-08441; SF_SKU: COM-00097

## Board
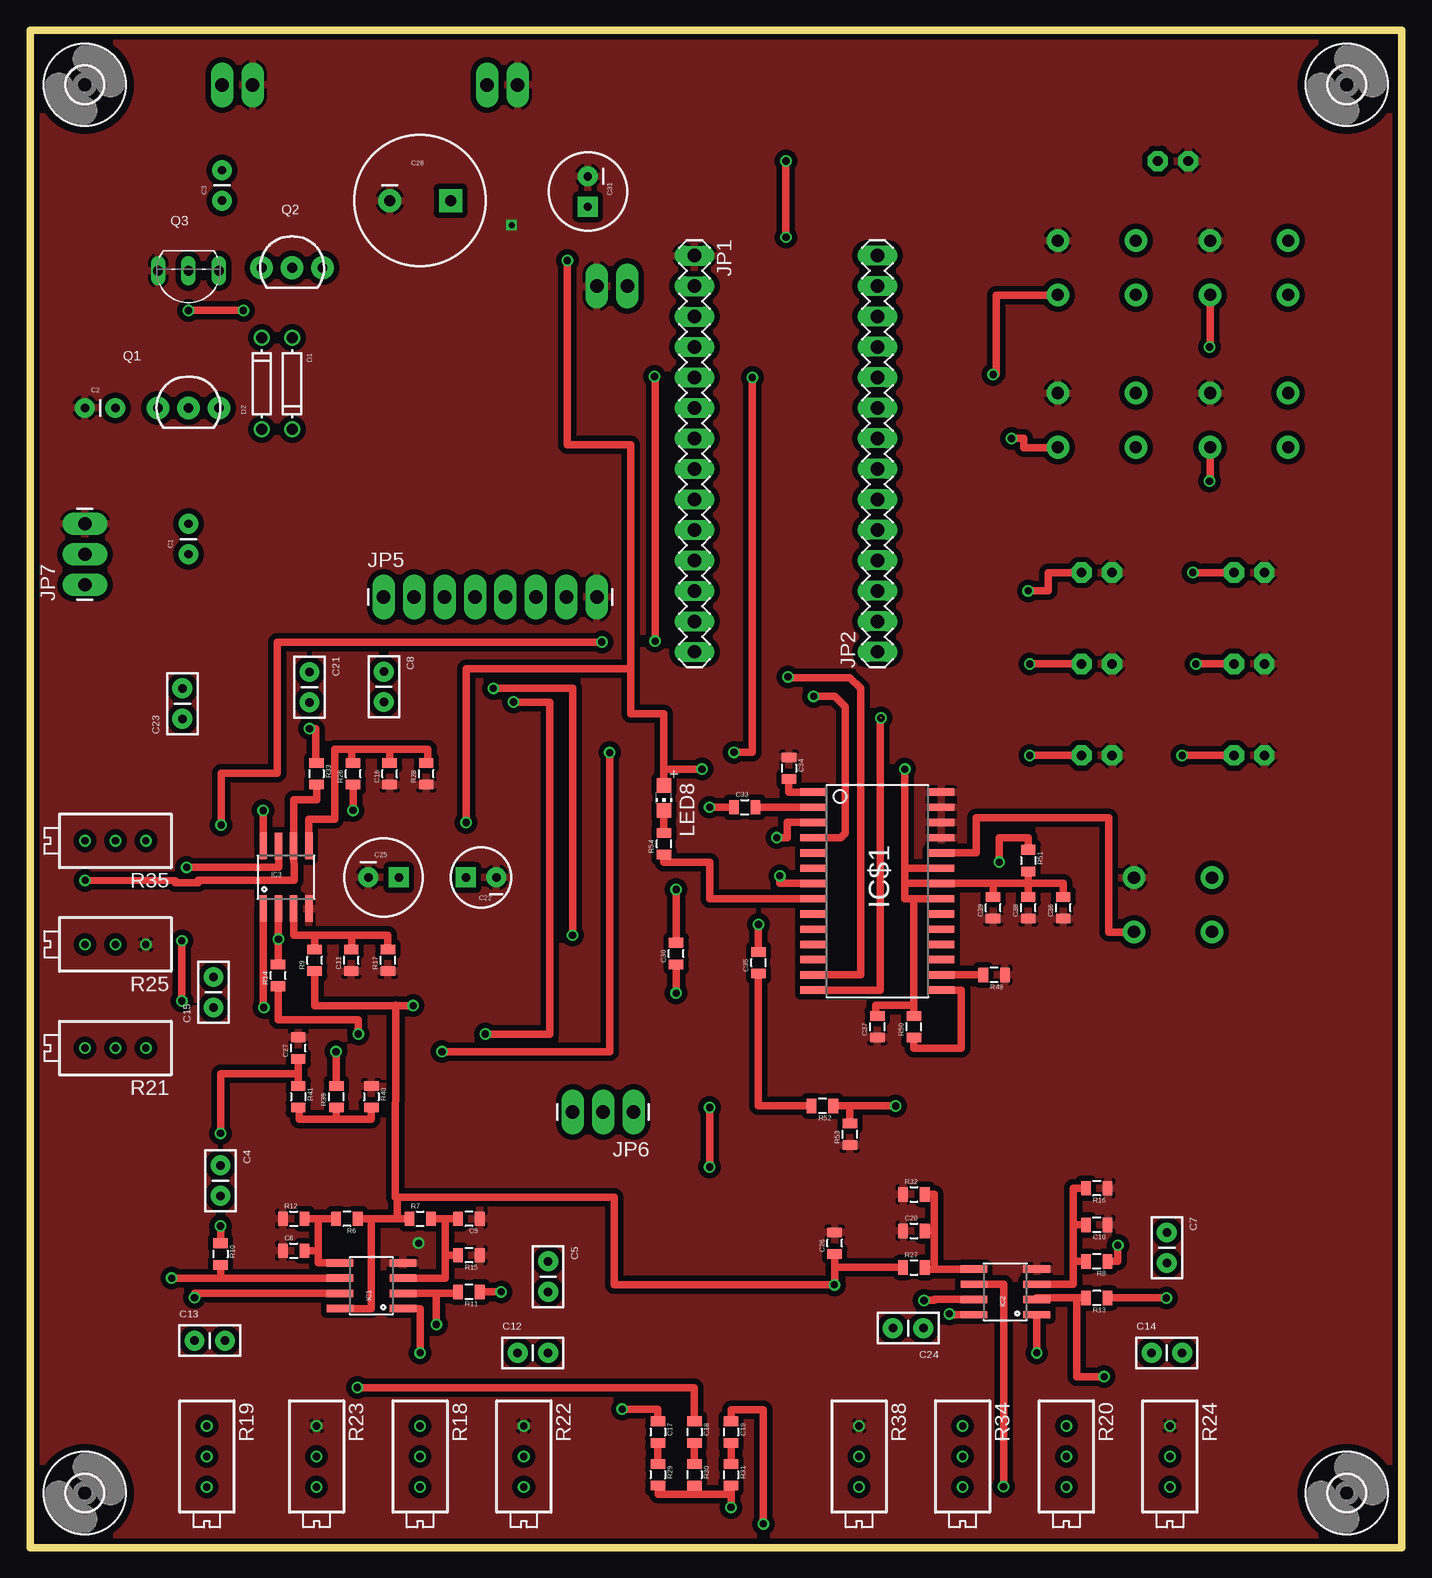
[diagram p5: board, top side]
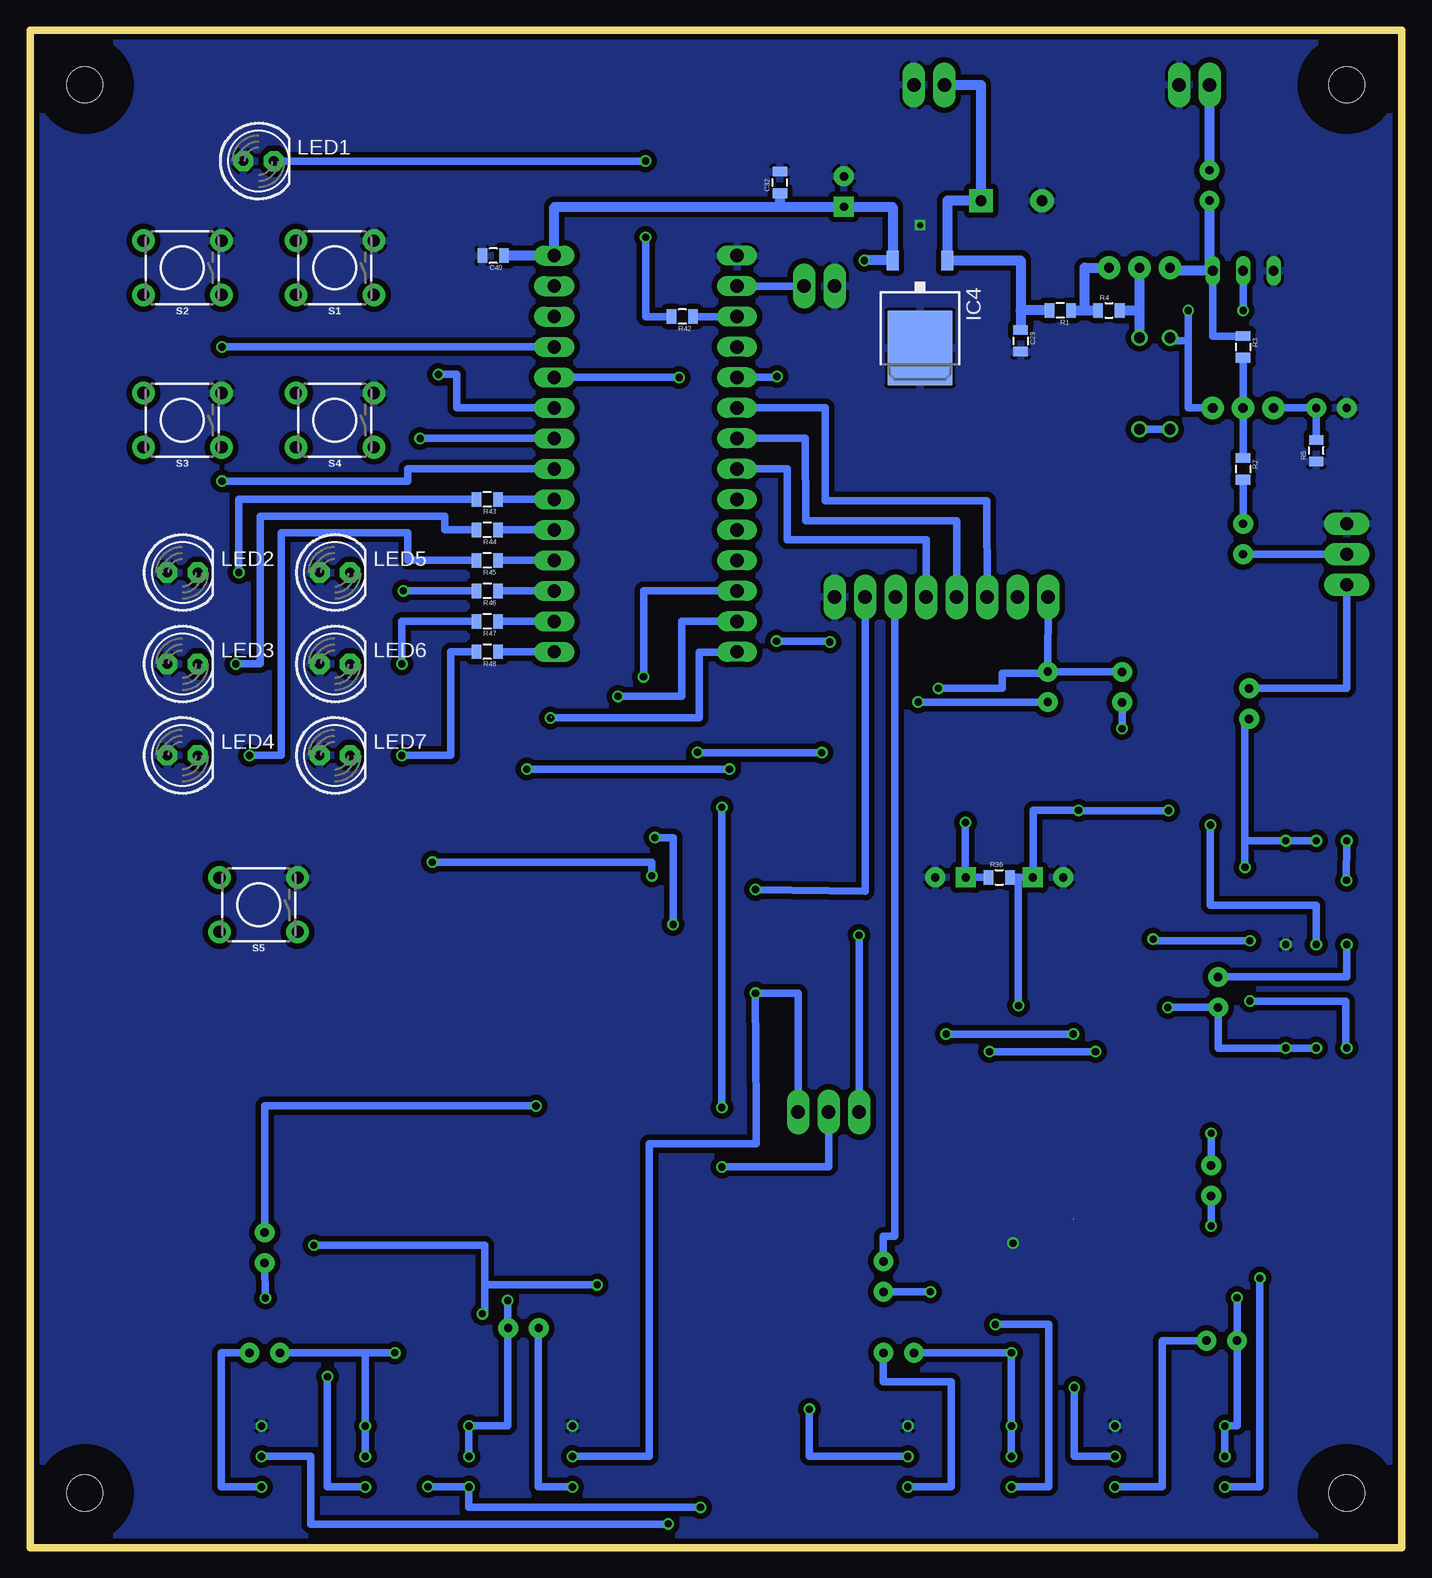
[diagram p6: board, bottom side, seen from below]

Size 114.3 x 126.49 mm. Coordinates in mm from the lower left corner, seen from the top.
Outline: 0,0 114.3,0 114.3,126.49 0,126.49 0,0
Copper layers (1*16): Top 0.0356mm / dielectric 1.5011mm / Bottom 0.0356mm
Design rules "LaenPCBOrder *": minimum track width 6mil, minimum drill 13mil, track to track 18mil, track to pad 12mil, pad to pad 6mil, via to via 6mil, smd to smd 6mil, copper to edge 18mil, drill to drill 6mil, minimum pad ring 7mil, minimum via ring 7mil, stop-mask expansion 3mil, vias tented up to drill 0mil, thermal gap 10mil

### Footprints (pad centres in the part's own frame; a part is rotated, then mirrored left to right if it is on the bottom)
CAP-PTH-SMALL = drill 0.7 pad 1.651: 1 0,0; 2 2.54,0
CAP-PTH-SMALL2 = drill 0.7 pad 1.651: 1 0,0; 2 2.54,0
0805 = smd 0.8 x 1.2: 1 -0.9,0; 2 0.9,0
CPOL-RADIAL-10UF-25V = drill 0.7 pad 1.651 square: 1 1.27,0 | drill 0.7 pad 1.651: 2 -1.27,0
CPOL-RADIAL-100UF-25V = drill 0.7 pad 1.651 square: 1 1.27,0 | drill 0.7 pad 1.651: 2 -1.27,0
CPOL-RADIAL-1000UF-25V = drill 0.9 pad 1.93 square: + 2.54,0 | drill 0.9 pad 1.93: - -2.54,0
DO-1N4148 = drill 0.9: A -3.81,0; C 3.81,0
SOIC8 = smd 0.61 x 2.21: 1 -1.905,-2.616; 2 -0.635,-2.616; 3 0.635,-2.616; 4 1.905,-2.616; 5 1.905,2.616; 6 0.635,2.616; 7 -0.635,2.616; 8 -1.905,2.616
TO252 = smd 1 x 1.6: 1 -2.28,-4.8; 2 2.28,-4.8 | smd 5.4 x 6.2: 3 0,2.5
SOIC-28 = smd 2.21 x 0.61: 1 5.315,-8.255; 2 5.315,-6.985; 3 5.315,-5.715; 4 5.315,-4.445; 5 5.315,-3.175; 6 5.315,-1.905; 7 5.315,-0.635; 8 5.315,0.635; 9 5.315,1.905; 10 5.315,3.175; 11 5.315,4.445; 12 5.315,5.715; 13 5.315,6.985; 14 5.315,8.255; 15 -5.315,8.255; 16 -5.315,6.985; 17 -5.315,5.715; 18 -5.315,4.445; 19 -5.315,3.175; 20 -5.315,1.905; 21 -5.315,0.635; 22 -5.315,-0.635; 23 -5.315,-1.905; 24 -5.315,-3.175; 25 -5.315,-4.445; 26 -5.315,-5.715; 27 -5.315,-6.985; 28 -5.315,-8.255
1X14-LONGPADS = drill 1.118 long: 1 0,0; 2 2.54,0; 3 5.08,0; 4 7.62,0; 5 10.16,0; 6 12.7,0; 7 15.24,0; 8 17.78,0; 9 20.32,0; 10 22.86,0; 11 25.4,0; 12 27.94,0; 13 30.48,0; 14 33.02,0
1X02_LONGPADS = drill 1.118 pad 1.88 long: 1 0,0; 2 2.54,0
1X08_LONGPADS = drill 1.118 pad 1.88 long: 1 0,0; 2 2.54,0; 3 5.08,0; 4 7.62,0; 5 10.16,0; 6 12.7,0; 7 15.24,0; 8 17.78,0
1X03_LONGPADS = drill 1.118 pad 1.88 long: 1 0,0; 2 2.54,0; 3 5.08,0
LED5MM = drill 0.813 pad 1.676 octagon: A -1.27,0; K 1.27,0
CHIP-LED0805 = smd 1.2 x 1.2: A 0,-1.05; C 0,1.05
TO-92-AMMO = drill 0.813 pad 1.88: 1 -2.54,0; 2 0,0; 3 2.54,0
TO92-EBC = drill 0.813 long: B 0,-1.27; C 2.54,-1.27; E -2.54,-1.27
RTRIM3296X = drill 0.61: 1 0,-2.54; 2 0,0; 3 0,2.54
TACTILE_SWITCH_PTH_6.0MM = drill 1.016 pad 1.88: 1 -3.251,2.261; 2 3.251,2.261; 3 -3.251,-2.261; 4 3.251,-2.261
3,0 = hole 3: 0,0

### Placement (x,y rotation side)
C1  13.21,82.8 90 top
C2  4.57,95 0 top
C3  16,112.27 90 top
C4  15.88,31.88 270 top
C5  43.18,23.88 270 top
C6  21.97,24.77 0 top
C7  94.74,26.29 270 top
C8  29.49,73.03 270 top
C9  36.58,27.43 180 top
C10  88.9,26.92 180 top
C11  26.77,48.97 90 top
C12  40.64,16.26 0 top
C13  13.72,17.27 0 top
C14  93.47,16.26 0 top
C15  15.29,45.03 90 top
C16  29.97,64.52 90 top
C17  52.32,9.65 270 top
C18  55.37,9.65 270 top
C19  58.42,9.65 270 top
C20  73.66,26.42 0 top
C21  23.29,73 270 top
C22  37.59,55.88 180 top
C23  12.7,69.09 90 top
C24  74.45,18.31 180 top
C25  29.46,55.88 0 top
C26  67.06,25.4 90 top
C27  22.35,41.66 90 top
C28  32.51,112.27 0 top
C29  31.75,100.58 270 bottom
C30  53.85,49.53 90 top
C31  46.48,113.03 270 top
C32  51.82,113.79 90 bottom
C33  59.56,61.72 0 top
C34  63.25,64.97 270 top
C35  60.71,48.77 90 top
C36  86.11,53.34 90 top
C37  70.61,43.43 90 top
C38  83.19,53.34 90 top
C39  80.26,53.34 90 top
C40  75.69,107.7 180 bottom
D1  21.84,97.03 270 top
D2  19.3,97.03 90 top
IC1  28.45,21.84 90 top
IC2  81.28,21.34 90 top
IC3  21.34,55.88 0 top
IC4  40.13,102.49 180 bottom
IC$1  70.61,54.74 180 top
JP1  55.37,107.7 270 top
JP2  70.61,74.68 90 top
JP3  16,121.92 0 top
JP4  38.1,121.92 0 top
JP5  29.46,79.25 0 top
JP6  50.29,36.32 180 top
JP7  4.57,80.26 90 top
LED1  95.25,115.57 0 bottom
LED2  101.6,81.28 0 bottom
LED3  101.6,73.66 0 bottom
LED4  101.6,66.04 0 bottom
LED5  88.9,81.28 0 bottom
LED6  88.9,73.66 0 bottom
LED7  88.9,66.04 0 bottom
LED8  52.83,62.48 180 top
MODE_SW  49.78,105.16 180 top
Q1  13.21,95 0 top
Q2  21.84,106.68 0 top
Q3  13.21,105.16 180 top
R1  28.45,103.12 180 bottom
R2  13.21,89.92 270 bottom
R3  13.21,100.08 270 bottom
R4  24.38,103.12 0 bottom
R5  7.11,91.44 90 bottom
R6  26.42,27.43 180 top
R7  32.51,27.43 0 top
R8  88.9,23.88 180 top
R9  23.72,48.97 90 top
R10  15.88,24.49 270 top
R11  36.58,21.34 180 top
R12  21.97,27.43 0 top
R13  88.9,20.83 180 top
R14  20.68,47.7 90 top
R15  36.58,24.38 180 top
R16  88.9,29.97 180 top
R17  29.82,48.97 90 top
R18  32.51,7.62 180 top
R19  14.73,7.62 180 top
R20  86.36,7.62 180 top
R21  7.11,41.66 90 top
R22  41.15,7.62 180 top
R23  23.88,7.62 180 top
R24  95,7.62 180 top
R25  7.11,50.29 90 top
R26  26.92,64.52 90 top
R27  73.66,23.37 0 top
R28  33.02,64.52 90 top
R29  52.32,6.1 270 top
R30  55.37,6.1 270 top
R31  58.42,6.1 270 top
R32  73.66,29.46 0 top
R33  23.88,64.52 270 top
R34  77.72,7.62 180 top
R35  7.11,58.93 90 top
R36  33.53,55.88 0 bottom
R38  69.09,7.62 180 top
R39  25.53,37.59 90 top
R40  28.45,37.59 270 top
R41  22.35,37.59 270 top
R42  59.94,102.62 180 bottom
R43  76.2,87.38 180 bottom
R44  76.2,84.84 180 bottom
R45  76.2,82.3 180 bottom
R46  76.2,79.76 180 bottom
R47  76.2,77.22 180 bottom
R48  76.2,74.68 180 bottom
R49  80.34,47.75 180 top
R50  73.66,43.43 90 top
R51  83.19,57.28 270 top
R52  66.04,36.83 180 top
R53  68.33,34.47 90 top
R54  52.83,58.67 90 top
S1  88.9,106.68 180 bottom
S2  101.6,106.68 180 bottom
S3  101.6,93.98 180 bottom
S4  88.9,93.98 180 bottom
S5  95.25,53.59 180 bottom
U$1  [3,0]  4.57,121.92 0 top
U$2  [3,0]  109.73,121.92 0 top
U$3  [3,0]  109.73,4.57 0 top
U$4  [3,0]  4.57,4.57 0 top

### Tracks (layer width: path | path; a pad name or v marks a point on that pad's centre or on a via)
A5V  (via drill 0.6)  (1 unrouted)
  Top 0.61: IC3.8 v19.43,61.44 | v26.92,61.47 R26.1 | IC1.8 28.45,19.94 28.45,27.43 | 27.36,27.43 28.45,27.43 | IC2.8 76.61,19.43 v76.61,19.51 | 67.06,23.37 67.06,21.92 v67.03,21.92 67.03,21.95 48.69,21.95 48.69,29.21 30.61,29.21 | 67.06,23.37 C26.1 | R27.1 67.06,23.37 | R8.1 90.65,23.88 v90.65,25.22 | 30.61,29.21 30.43,29.21 30.48,45.09 | 30.48,45.09 30.48,45.21 30.48,45.19 | 28.45,27.43 R7.1 30.61,27.43 30.61,29.21 | R9.1 23.72,45.19 v31.93,45.19 30.48,45.19 | 30.48,45.19 30.48,45.09
  Bottom 0.61: v19.43,61.44 26.92,61.44 v26.92,61.47 30.68,61.47 30.68,55.88 C25.1 | C25.1 R36.2 | v76.61,19.51 76.4,19.51 76.4,21.92 | 76.4,21.92 v67.03,21.92 | v90.65,25.22 76.4,25.22 76.4,21.92 | C25.1 31.93,55.88 v31.93,45.19
AUDIO_AMP
  Bottom 0.61: C1.1 JP7.2
CH_A  (via drill 0.6)
  Top 0.61: v49.35,11.56 52.32,11.56 C17.1
  Bottom 0.61: R22.2 49.35,7.62 v49.35,11.56
CH_B  (via drill 0.6)
  Top 0.61: v27.28,13.36 55.37,13.36 C18.1
  Bottom 0.61: R23.2 27.28,7.62 v27.28,13.36
CH_C  (via drill 0.6)
  Top 0.61: v61.11,2.01 61.11,11.53 58.42,11.53 C19.1
  Bottom 0.61: R24.2 90.91,7.62 90.91,1.98 61.11,1.98 v61.11,2.01
COS_AUDIO  (via drill 0.6)
  Top 0.61: v52.05,97.61 52.09,97.61 v52.09,75.56 | v47.65,75.49 20.6,75.49 20.6,64.57 15.93,64.57 v15.93,60.25
  Bottom 0.61: JP1.5 52.05,97.54 v52.05,97.61 | v52.09,75.56 47.65,75.56 v47.65,75.49 | v15.93,60.25 15.93,53.57 7.11,53.57 R25.2
CW_AUDIO  (via drill 0.6)
  Top 0.61: v15.88,34.54 15.88,39.5 22.35,39.5 R41.1 C27.1
  Bottom 0.61: v15.88,34.54 C4.1
CW_TONE_OUT  (via drill 0.6)
  Top 0.61: R39.2 25.5,38.49 v25.5,41.35 | v34.34,41.35 48.31,41.35 v48.31,66.27 | v58.67,66.29 60.2,66.29 v60.2,97.54
  Bottom 0.61: v25.5,41.35 v34.34,41.35 | v48.31,66.27 58.67,66.27 v58.67,66.29 | v60.2,97.54 JP2.10
ERASE  (via drill 0.6)
  Top 0.61: v65.3,70.97 67.08,70.97 67.94,70.1 67.94,59.56 67.56,59.18 IC$1.4
  Bottom 0.61: v65.3,70.97 59.97,70.97 59.97,77.22 JP1.13
ERASE_IN  (via drill 0.6)
  Top 0.61: v81.79,92.46 82.8,92.46 82.8,91.69 85.65,91.69 S4.1
  Bottom 0.61: v81.79,92.46 JP2.8
GND  (via drill 0.5, 0.6)
  other vias: 40.13,110.24 32.38,25.4
  pour Bottom: -0.51,0 114.3,0 114.3,126.49 0,126.49
  pour Top: 0,0 114.3,0 114.3,126.49 0,126.49
LED_COS
  Bottom 0.61: JP2.4 R45.1
LED_CWID
  Bottom 0.61: JP2.3 R46.1
LED_HEARTBEAT
  Bottom 0.61: JP2.6 R43.1
LED_INIT
  Bottom 0.61: JP1.3 R42.1
LED_PTT
  Bottom 0.61: JP2.5 R44.1
LED_RECORDING
  Bottom 0.61: JP2.1 R48.1
LED_VOICEID
  Bottom 0.61: JP2.2 R47.1
MIC_AUDIO_IN
  Bottom 0.61: JP5.6 42.24,79.25 42.24,25.98 43.18,25.98 C5.1
MIC_PTT_IN
  Bottom 0.61: JP1.7 49.68,92.46 49.66,85.6 37.08,85.6 JP5.4
MODE_IN
  Bottom 0.61: JP1.2 MODE_SW.1
N$1
  Top 0.61: C33.2 IC$1.2
N$2  (via drill 0.6)
  Top 0.61: C35.2 v60.71,51.94 | v62.23,59.18 63.12,59.18 63.12,60.45 IC$1.3
  Bottom 0.61: v60.71,51.94 60.71,59.18 v62.23,59.18
N$3
  Top 0.61: C35.1 60.71,36.83 R52.2
N$4
  Top 0.61: C34.2 63.25,62.99 IC$1.1
N$5
  Top 0.61: IC$1.16 R49.2
N$6  (via drill 0.6)
  Top 0.61: R51.1 83.19,59.18 80.77,59.18 v80.77,57.15 | v62.48,56.01 62.48,55.37 IC$1.7
  Bottom 0.61: v80.77,57.15 62.48,57.15 v62.48,56.01
N$7
  Top 0.61: R54.1 52.83,57.15 56.64,57.15 56.64,54.1 IC$1.8
N$8
  Top 0.61: LED8.C R54.2
N$9  (via drill 0.6)
  Top 0.61: v62.99,109.22 v62.99,115.57
  Bottom 0.61: R42.2 62.99,102.62 v62.99,109.22 | v62.99,115.57 LED1.K
N$10  (via drill 0.6)
  Top 0.61: v96.9,81.28 LED2.K
  Bottom 0.61: R43.2 96.9,87.38 v96.9,81.28
N$11  (via drill 0.6)
  Top 0.61: LED3.K v97.16,73.66
  Bottom 0.61: v97.16,73.66 95.12,73.66 95.12,85.98 79.76,85.98 79.76,84.84 R44.2
N$12  (via drill 0.6)
  Top 0.61: LED4.K v96.01,66.04
  Bottom 0.61: v96.01,66.04 93.34,66.04 93.34,84.58 82.8,84.58 82.8,82.3 R45.2
N$13  (via drill 0.6)
  Top 0.61: v83.19,79.76 84.84,79.76 84.84,81.28 LED5.K
  Bottom 0.61: R46.2 v83.19,79.76
N$14  (via drill 0.6)
  Top 0.61: v83.31,73.66 LED6.K
  Bottom 0.61: R47.2 83.31,77.22 v83.31,73.66
N$15  (via drill 0.6)
  Top 0.61: v83.31,66.04 LED7.K
  Bottom 0.61: R48.2 79.25,74.68 79.25,66.04 v83.31,66.04
N$16
  Top 0.61: R41.2 22.43,36.69 22.43,35.74 25.53,35.74 | 25.53,35.74 28.45,35.74 R40.2 | 25.38,36.69 R39.1 25.53,35.74
N$17  (via drill 0.6)
  Top 0.61: C30.2 v53.85,54.86
  Bottom 0.61: v53.85,54.86 44.7,54.71 JP5.7
N$25
  Bottom 0.61: R2.2 C1.2
N$28
  Bottom 0.61: R4.1 26.42,103.12
  Bottom 0.813: R1.1 R4.1 | 26.42,103.12 26.42,106.68 Q2.3
N$30
  Bottom 0.61: Q1.1 C2.2 R5.2
N$40
  Bottom 0.61: R3.1 15.75,100.98 Q3.E 16,106.43 | 19.3,106.43 Q2.1
  Bottom 0.813: Q3.E 19.3,106.43 | 16,106.43 C3.1
N$41
  Bottom 0.61: D2.A D1.C
N$42
  Bottom 0.813: Q2.2 21.84,103.12 | 21.84,103.12 D1.A | R4.2 21.84,103.12
N$43  (via drill 0.6)
  Top 0.61: v13.21,103.12 v17.78,103.12
  Bottom 0.61: Q1.3 17.78,95 17.78,100.58 | 17.78,100.58 19.3,100.58 D2.C | Q3.B v13.21,103.12 | v17.78,103.12 17.78,100.58
N$44  (via drill 0.6)
  Top 0.61: R11.2 35.68,21.21 IC1.2 33.86,21.21 v33.86,18.62
  Bottom 0.61: v33.86,18.62 29.39,18.62 29.39,5.08 R18.3
N$45
  Top 0.61: R7.2 34.62,27.43 | 34.62,27.43 C9.2 | R15.2 34.62,24.38 | 34.62,24.38 34.62,27.43 | IC1.3 34.62,22.48 34.62,24.38
N$53
  Bottom 0.61: R2.1 Q1.2 R3.2
N$54  (via drill 0.6)
  Top 0.61: R11.1 v39.27,21.34
  Bottom 0.61: v39.27,21.34 C5.2
N$55  (via drill 0.6)
  Top 0.61: IC1.1 32.51,19.94 v32.51,16.26
  Bottom 0.61: C12.1 v32.51,16.26 32.51,15.93 R18.1 R18.2
N$56
  Bottom 0.61: C12.2 43.18,13.84 37.54,13.84 37.54,5.08 R22.3
N$57  (via drill 0.6)
  Top 0.61: v11.81,22.48 15.88,22.48 | 15.88,22.48 IC1.6 | R10.2 15.88,22.48
  Bottom 0.61: R19.3 11.81,5.08 v11.81,22.48
N$58
  Top 0.61: IC1.5 24.03,23.75 24.03,24.64 24.03,24.77 | 24.03,24.77 24.03,27.43 | 24.03,27.43 R6.2 | R12.2 24.03,27.43 | C6.2 24.03,24.77
N$59  (via drill 0.6)
  Top 0.61: v15.88,26.82 R10.1
  Bottom 0.61: C4.2 v15.88,26.82
N$60  (via drill 0.6)
  Top 0.61: IC1.7 13.72,21.21 v13.72,20.85
  Bottom 0.61: R19.2 R19.1 13.72,10.16 C13.1 v13.72,20.85
N$61
  Bottom 0.61: C13.2 19.94,17.27 19.94,5.08 23.82,5.08 | 23.82,5.08 R23.3 23.88,5.16 23.82,5.08
N$62  (via drill 0.6)
  Top 0.61: R13.2 87.25,20.83 | 87.25,20.83 83.9,20.83 IC2.2 | v89.51,14.28 87.25,14.28 87.25,20.83
  Bottom 0.61: R20.3 89.51,5.08 v89.51,14.28
N$63
  Top 0.61: IC2.3 86.94,21.97 86.94,23.88 | R8.2 86.94,23.88 | 86.94,23.88 86.94,26.92 | 86.94,26.92 86.94,29.97 R16.2 | C10.2 86.94,26.92
N$64  (via drill 0.6)
  Top 0.61: v94.69,20.83 R13.1
  Bottom 0.61: C7.2 v94.69,20.83
N$65  (via drill 0.6)
  Top 0.61: v83.9,16.26 IC2.1
  Bottom 0.61: R20.2 R20.1 86.36,16.26 | 86.36,16.26 C14.1 | 86.36,16.26 v83.9,16.26
N$66
  Bottom 0.61: R24.3 98.35,5.08 98.35,16.26 C14.2
N$67  (via drill 0.6)
  Top 0.61: R29.2 52.38,5.2 52.38,4.47 55.35,4.47 | 55.35,4.47 55.37,4.47 | 55.37,4.47 R30.2 55.35,5.2 55.35,4.47 | 55.37,4.47 58.42,4.47 R31.2 v58.42,3.38 | IC2.6 81.13,21.97 v81.13,5.11
  Bottom 0.61: v58.42,3.38 77.72,3.38 R34.3 77.72,5.11 v81.13,5.11
N$68
  Top 0.61: IC2.5 75.36,23.24 | 75.36,23.24 74.56,23.24 R27.2 | R32.2 75.36,29.46 75.36,26.42 | C20.2 75.36,26.42 | 75.36,26.42 75.36,23.24
N$69  (via drill 0.6)
  Top 0.61: v74.5,20.62 75.36,20.62 75.36,20.7 IC2.7
  Bottom 0.61: C24.1 74.47,18.31 | v74.5,20.62 74.5,18.31 74.47,18.31 | 74.47,18.31 74.47,10.16 R34.1 R34.2
N$70
  Bottom 0.61: C24.2 71.93,18.19 71.93,14.68 71.93,5.11 69.09,5.11 R38.3
N$71  (via drill 0.6)
  Top 0.61: R14.2 20.7,48.6 20.7,50.55 v20.7,50.72 IC3.2 | v12.65,45.57 v12.65,50.6
  Bottom 0.61: R21.3 4.65,41.66 4.65,45.57 v12.65,45.57 | v12.65,50.6 20.7,50.6 v20.7,50.72
N$72
  Top 0.61: IC3.3 21.97,51.05 23.75,51.05 | 23.75,51.05 26.8,51.05 | 26.8,51.05 29.82,51.05 R17.2 | C11.2 26.8,49.87 26.8,51.05 | R9.2 23.75,49.87 23.75,51.05
N$73  (via drill 0.6)
  Top 0.61: v40.28,70.48 43.31,70.48 43.31,42.82 v37.95,42.82 | v27.36,42.82 27.36,44.02 20.68,44.02 R14.1
  Bottom 0.61: C8.2 v40.28,70.48 | v27.36,42.82 v37.95,42.82
N$74  (via drill 0.6)
  Top 0.61: v19.48,45.03 19.43,45.03 IC3.1
  Bottom 0.61: R21.2 R21.1 15.29,41.66 C15.1 v19.48,45.03
N$75
  Bottom 0.61: C15.2 15.14,47.57 15.14,47.6 4.57,47.6 R25.3
N$76  (via drill 0.6)
  Top 0.61: R33.2 23.88,62.36 21.97,62.36 IC3.6 22,58.5 22.02,55.63 14.02,55.63 14.02,55.42 12.12,55.42 12.12,55.6 v4.6,55.63
  Bottom 0.61: v4.6,55.63 R35.3
N$77
  Top 0.61: IC3.5 23.24,60.71 25.4,60.71 25.4,66.55 26.8,66.55 | 26.8,66.55 29.97,66.55 | 29.97,66.55 C16.2 | R26.2 26.8,65.42 26.8,66.55 | R28.2 33.15,65.42 33.15,66.55 29.97,66.55
N$78  (via drill 0.6)
  Top 0.61: R33.1 23.82,65.42 23.82,68.25 v23.29,68.28
  Bottom 0.61: v23.29,68.28 C21.2
N$79  (via drill 0.6)
  Top 0.61: IC3.7 20.73,58.5 20.73,56.72 v13.06,56.72
  Bottom 0.61: R35.2 R35.1 13.06,58.93 | 13.06,58.93 13.06,69.09 C23.1 | v13.06,56.72 13.06,58.93
N$87
  Top 0.61: C17.2 R29.1
N$88
  Top 0.61: C18.2 R30.1
N$89
  Top 0.61: C19.2 R31.1
PLAY  (via drill 0.6)
  Top 0.61: IC$1.13 69.22,47.75 69.22,71.63 68.33,72.52 63.25,72.52 v63.17,72.59 63.17,72.52
  Bottom 0.61: v63.17,72.59 63.17,79.76 JP1.12
PLAY_CWID_IN  (via drill 0.6)
  Top 0.61: v98.3,100.08 98.35,100.08 S2.1
  Bottom 0.61: JP2.11 v98.3,100.08
PLAY_VOICEID_IN  (via drill 0.6)
  Top 0.61: v80.26,97.79 80.52,97.79 80.52,104.39 85.65,104.39 S1.1
  Bottom 0.61: v80.26,97.79 78.74,97.79 78.74,95 JP2.9
PREAMP_OUT
  Bottom 0.61: JP7.1 4.57,71.63 C23.2
REC_AUDIO_IN  (via drill 0.6)
  Top 0.61: C33.1 v56.64,61.72 | v56.64,36.7 v56.64,31.75
  Bottom 0.61: v56.64,61.72 v56.64,36.7 | v56.64,31.75 47.75,31.75 JP6.2
RECORD  (via drill 0.6)  (1 unrouted)
  Top 0.61: IC$1.14 70.87,46.48 70.87,69.22
  Bottom 0.61: v70.92,69.16 58.52,69.16 58.52,74.65 55.37,74.65 JP1.14
RECORD_IN  (via drill 0.6)
  Top 0.61: v98.3,88.9 98.35,88.9 S3.1
  Bottom 0.61: v98.3,88.9 82.8,88.9 82.8,89.92 JP2.7
RESET
  Top 0.61: IC$1.15 77.6,46.48 77.6,41.66 73.66,41.66 R50.1
RPTR_AUDIO_IN  (via drill 0.6)
  Top 0.61: v38.61,71.63 45.21,71.63 v45.21,51.05
  Bottom 0.61: JP5.1 C8.1 | C21.1 C8.1 | JP6.3 v45.21,51.05 | v38.61,71.63 33.27,71.63 33.27,72.9 29.49,72.9 C8.1
RPTR_MIC  (via drill 0.6)
  Top 0.61: v53.85,46.23 C30.1
  Bottom 0.61: R38.2 62.71,7.62 62.71,33.68 53.77,33.68 53.79,36.32 v53.85,46.23 50.29,46.23 JP6.1
RPTR_MONITOR
  Bottom 0.61: JP5.5 39.62,84 51.21,84 51.21,89.92 JP1.8
RPTR_PTT
  Bottom 0.61: JP1.6 48.03,95 48.03,87.25 34.57,87.25 JP5.3
SPEAKER
  Bottom 0.813: C3.2 JP3.1
VCC_12V
  Bottom 0.813: JP4.1 35.05,121.92 C28.+ 37.85,112.27 IC4.1 31.75,107.29 31.75,103.12 | 31.75,103.12 C29.1 | R1.2 31.75,103.12
VDD_5V  (via drill 0.6)
  Top 0.61: 52.83,66.55 52.83,66.02 | v44.78,107.29 44.78,91.92 50.06,91.92 50.06,73.25 | 52.83,66.02 52.81,66.04 52.81,69.49 50.06,69.49 50.06,72.21 | 50.06,73.25 50.06,72.21 | 50.06,72.62 50.06,72.21 | v36.35,60.45 36.35,73.25 50.06,73.25 | 52.83,66.02 52.83,64.9 | 52.83,64.9 LED8.A arc60 52.83,63.5 | 72.9,56.64 v72.9,64.9 | v56.01,64.9 52.83,64.9 | IC$1.23 72.9,56.64 | 72.9,56.64 72.9,55.37 | 72.9,55.37 IC$1.22 80.26,55.37 | 72.9,55.37 72.9,54.1 73.66,54.1 | 73.66,54.1 IC$1.21 | 73.66,54.1 73.66,45.21 | 73.66,45.21 R50.2 | C37.2 70.48,44.33 70.48,45.21 73.66,45.21 | 83.19,55.37 R51.2 | C39.2 80.26,55.37 | 80.26,55.37 83.19,55.37 | C38.2 83.19,55.37 | 83.19,55.37 86.11,55.37 C36.2
  Bottom 0.61: v44.78,107.29 | R36.1 C22.1 36.35,55.88 v36.35,60.45 | v72.9,64.9 v56.01,64.9
  Bottom 0.813: C40.1 JP2.14 70.61,111.76 51.82,111.76 | 51.82,111.76 C31.1 42.41,111.76 IC4.2 v44.78,107.29 | C32.1 51.82,111.76
VOICEID_AUDIO  (via drill 0.6)
  Top 0.61: R52.1 68.33,36.83 | 68.33,36.83 v72.14,36.83 | R53.2 68.33,36.83
  Bottom 0.61: v72.14,36.83 94.74,36.83 C7.1
VOLUME
  Top 0.61: IC$1.24 78.87,57.91 78.87,60.83 89.92,60.83 89.92,51.31 92,51.31 S5.1